# Altium project RPi_CM4_Testadapter.PrjPcb
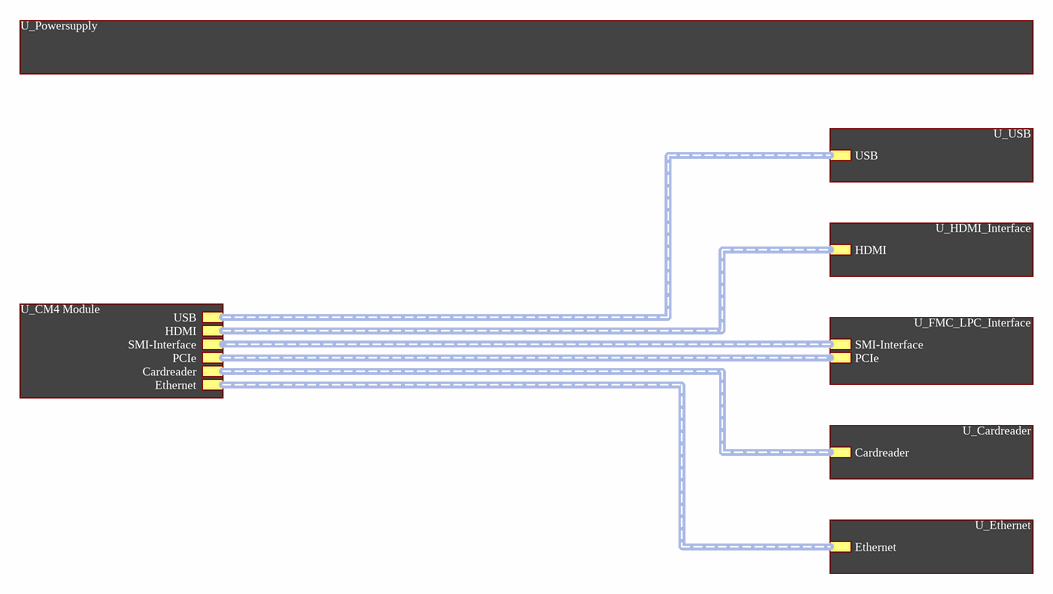
[diagram p0: 00_Top_Level_Sheet.SchDoc]
8 sheets, 141 parts. Net scope: hierarchical (ports join the sheet entries above them; power ports are global).
Board file: CM4 to FMC Adapter r2.0.PcbDoc
Sheets:
  00_Top_Level_Sheet.SchDoc
    U_Powersupply = 01_Powersupply.SchDoc
    U_CM4 Module = 02_CM4 Module.SchDoc
    U_Cardreader = 05_Cardreader.SchDoc
    U_Ethernet = 06_Ethernet.SchDoc
    U_USB = 03_USB.SchDoc
    U_HDMI_Interface = 04_HDMI_Interface.SchDoc
    U_FMC_LPC_Interface = 07_FMC_LPC_Interface.SchDoc

## Sheet 00_Top_Level_Sheet.SchDoc
size A3

### Sub-sheets
U_Cardreader = 05_Cardreader.SchDoc: Cardreader (harness Cardreader)
U_CM4 Module = 02_CM4 Module.SchDoc: Ethernet (harness Ethernet), Cardreader (harness Cardreader), SMI-Interface (harness SMI-Interface), HDMI (harness HDMI), USB (harness USB-A), PCIe (harness PCIe)
U_Ethernet = 06_Ethernet.SchDoc: Ethernet (harness Ethernet)
U_FMC_LPC_Interface = 07_FMC_LPC_Interface.SchDoc: SMI-Interface (harness SMI-Interface), PCIe (harness PCIe)
U_HDMI_Interface = 04_HDMI_Interface.SchDoc: HDMI (harness HDMI)
U_Powersupply = 01_Powersupply.SchDoc: no entries
U_USB = 03_USB.SchDoc: USB (harness USB-A)

### Buses and harness runs
harness sheet U_Cardreader/Cardreader = sheet U_CM4 Module/Cardreader
harness sheet U_CM4 Module/Ethernet = sheet U_Ethernet/Ethernet
harness sheet U_CM4 Module/HDMI = sheet U_HDMI_Interface/HDMI
harness sheet U_CM4 Module/PCIe = sheet U_FMC_LPC_Interface/PCIe
harness sheet U_CM4 Module/SMI-Interface = sheet U_FMC_LPC_Interface/SMI-Interface
harness sheet U_CM4 Module/USB = sheet U_USB/USB

### Notes on the sheet
- Title:
- ++CONFIDENTIAL++
- Date:
- Sheet:
- /
- Time:
- Engineer
- Elektronik- und Softwareentwicklung aus Nürnberg
- The  information  contained  in  these  documents  is  confidential,  privileged  and  only  for  the
  information of the intended recipient and may
  not be used, published or redistributed without
  the prior written consent from PCB Arts GmbH.
- Revision:
- Checked:
- https://pcb-arts.com/
- mail@pcb-arts.com

## Sheet 01_Powersupply.SchDoc
size A3
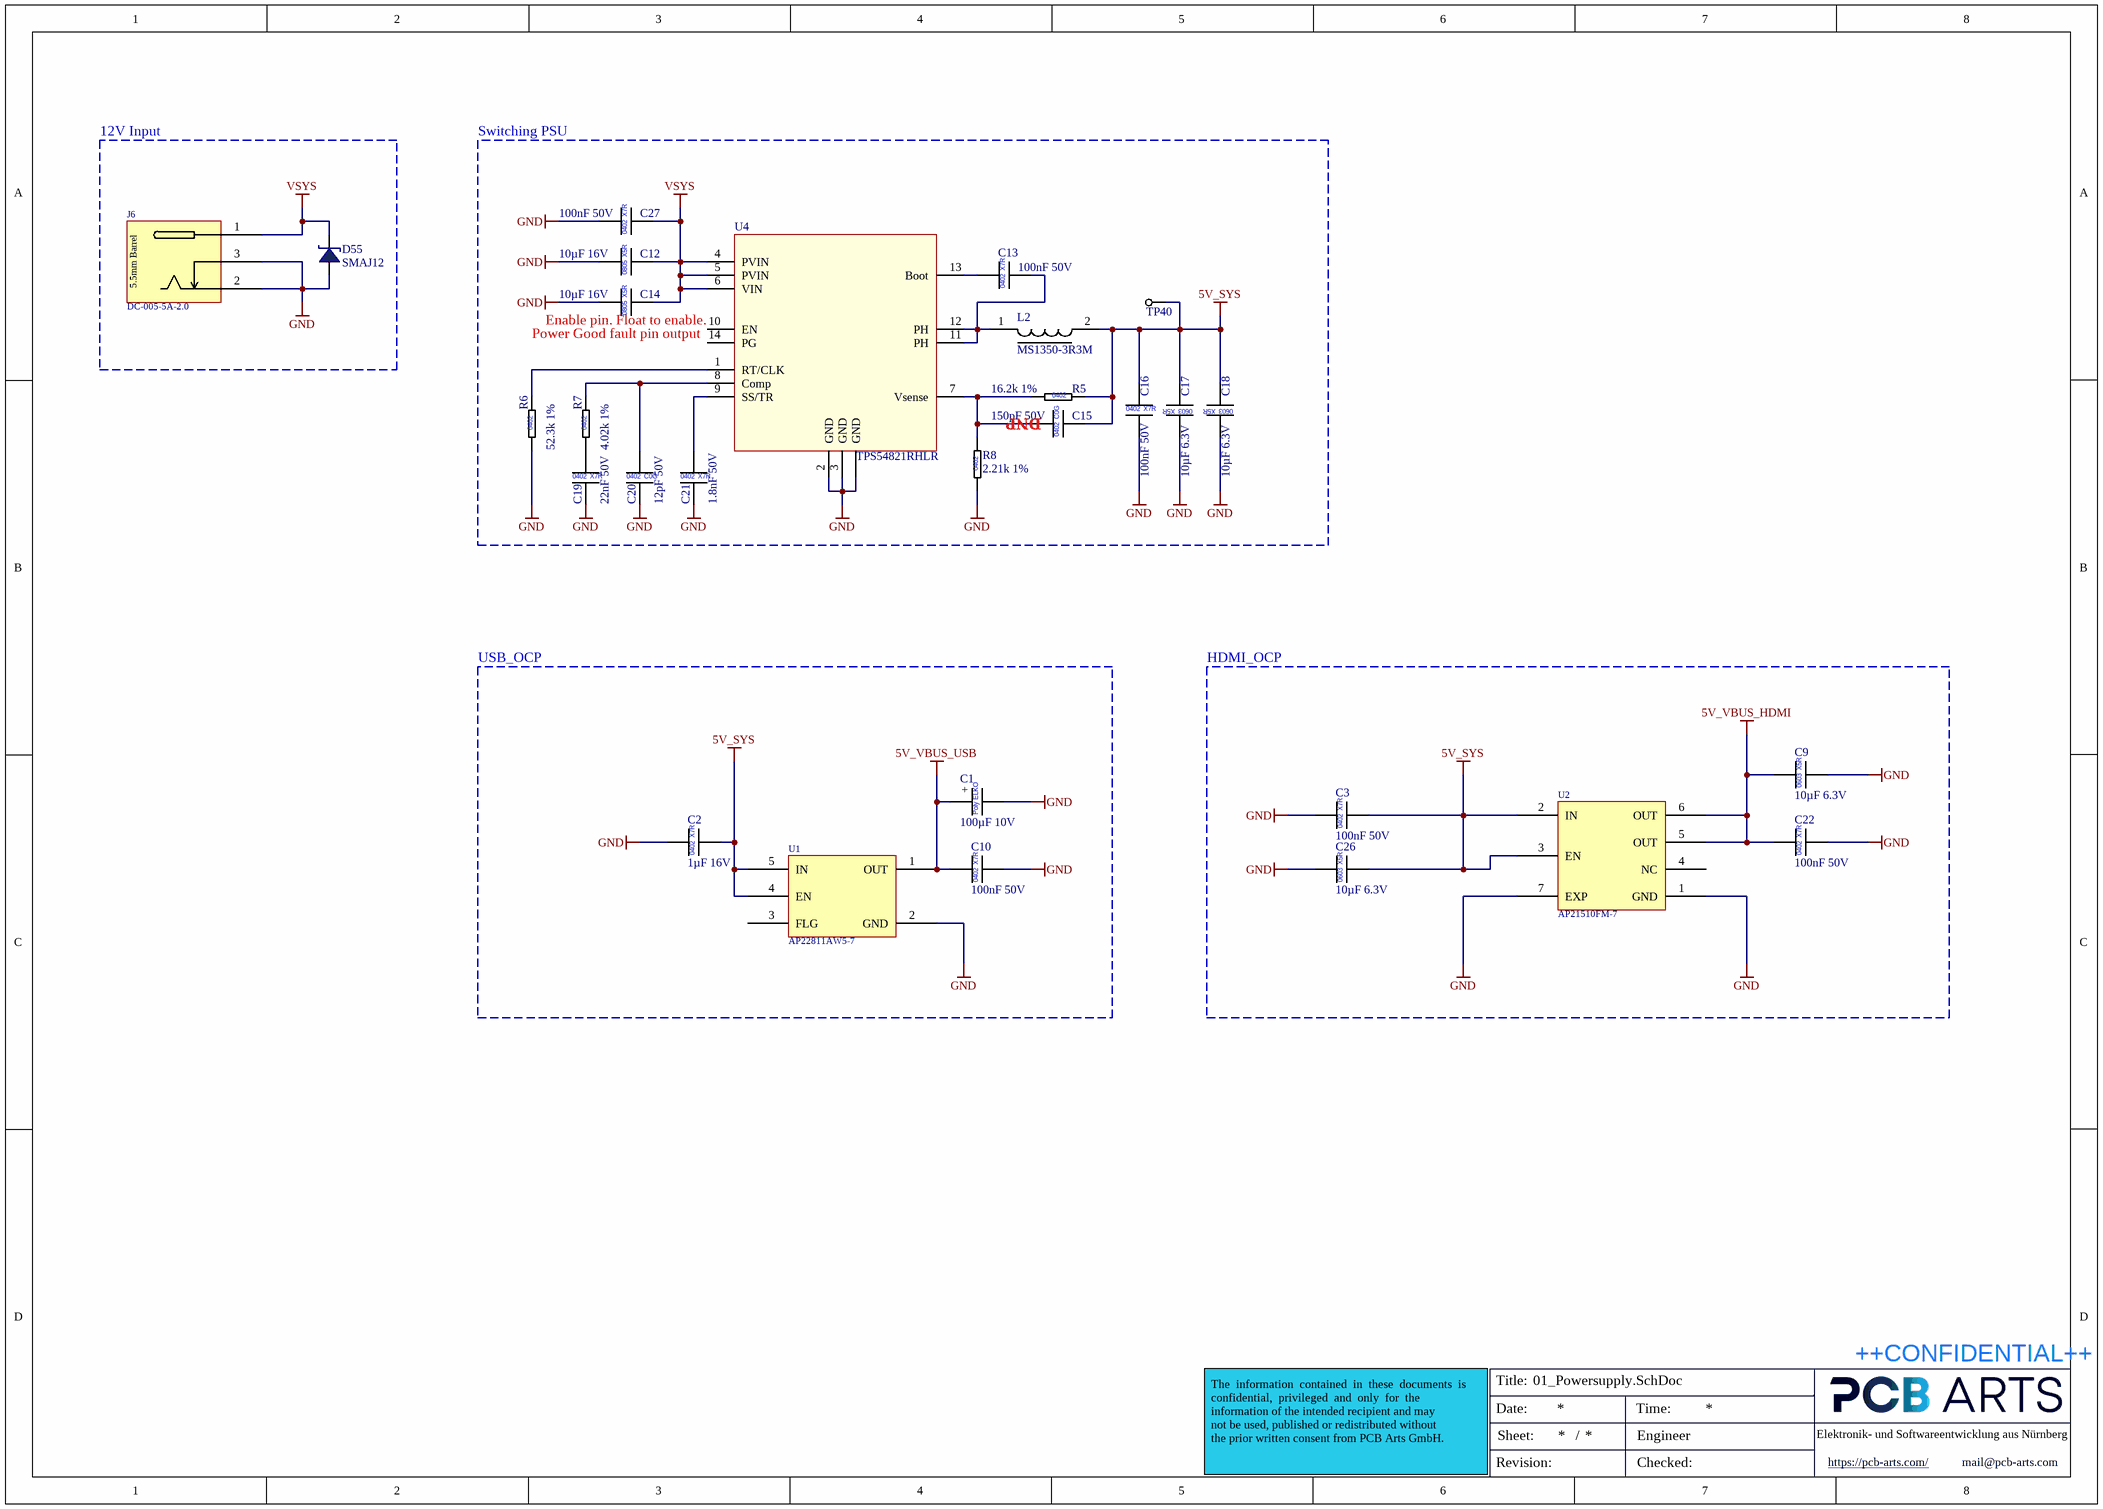
[diagram p1: 01_Powersupply.SchDoc]

### Parts
C1  100µF 10V  [WCAP-ASLI_D5H5.5]
C2  1µF 16V  [CAP_0402]
C3  100nF 50V  [CAP_0402]
C9  10µF 6.3V  [CAP_0603]
C10  100nF 50V  [CAP_0402]
C12  10µF 16V  [CAP_0805]
C13  100nF 50V  [CAP_0402]
C14  10µF 16V  [CAP_0805]
C15  150pF 50V  [CAP_0402]  (no BOM)
C16  100nF 50V  [CAP_0402]
C17  10µF 6.3V  [CAP_0603]
C18  10µF 6.3V  [CAP_0603]
C19  22nF 50V  [CAP_0402]
C20  12pF 50V  [CAP_0402]
C21  1.8nF 50V  [CAP_0402]
C22  100nF 50V  [CAP_0402]
C26  10µF 6.3V  [CAP_0603]
C27  100nF 50V  [CAP_0402]
D55  SMAJ12  [DO214AC]
J6  DC-005-5A-2.0  [DC-005-5A-2.0]
L2  MS1350-3R3M  [MS1350]
R5  16.2k 1%  [RES_0402]
R6  52.3k 1%  [RES_0402]
R7  4.02k 1%  [RES_0402]
R8  2.21k 1%  [RES_0402]
TP40  Testpoint  [Testpoint 0.8mm]  (value not drawn)  (no BOM)
U1  AP22811AW5-7  [SOT95P285X140-5N]
U2  AP21510FM-7  [QFN50P201X181X60_HS-7N]
U4  TPS54821RHLR  [VQFN14U3535]

### Blocks framed on the sheet
12V Input: D55 J6
DNP: C12-C21 C27 L2 R5-R8 TP40 U4
USB_OCP: C1 C2 C10 U1
HDMI_OCP: C3 C9 C22 C26 U2

### Nets
5V_SYS: C2.2 C3.2 C15.2 C16.1 C17.2 C18.2 C26.2 L2.2 R5.2 TP40.1(GND) U1.4(EN) U1.5(IN) U2.2(IN) U2.3(EN)
5V_VBUS_HDMI: C9.1 C22.1 U2.5(OUT) U2.6(OUT)
5V_VBUS_USB: C1.1 C10.1 U1.1(OUT)
GND: C1.2 C2.1 C3.1 C9.2 C10.2 C12.1 C14.1 C16.2 C17.1 C18.1 C19.2 C20.2 C21.2 C22.2 C26.1 C27.1 D55.2 J6.2 J6.3 R6.1 R8.1 U1.2(GND) U2.1(GND) U2.7(EXP) U4.2(GND) U4.3(GND) U4.EXP(GND)
VSYS: C12.2 C14.2 C27.2 D55.1 J6.1 U4.4(PVIN) U4.5(PVIN) U4.6(VIN)
NetC13_1: C13.1 U4.13(Boot)
NetC13_2: C13.2 L2.1 U4.11(PH) U4.12(PH)
NetC15_1: C15.1 R5.1 R8.2 U4.7(Vsense)
NetC19_1: C19.1 R7.1
NetC20_1: C20.1 R7.2 U4.8(Comp)
NetC21_1: C21.1 U4.9(SS/TR)
NetR6_2: R6.2 U4.1(RT/CLK)

Not connected (* = marked no-connect by the designer): U1 3(FLG); U2 4(NC); U4 10(EN) 14(PG)

### Notes on the sheet
- Switching PSU
- (near U4) Power Good fault pin output
- (near U4) Enable pin. Float to enable.
- Title:
- ++CONFIDENTIAL++
- Date:
- Sheet:
- /
- Time:
- Engineer
- Elektronik- und Softwareentwicklung aus Nürnberg
- The  information  contained  in  these  documents  is  confidential,  privileged  and  only  for  the
  information of the intended recipient and may
  not be used, published or redistributed without
  the prior written consent from PCB Arts GmbH.
- Revision:
- Checked:
- https://pcb-arts.com/
- mail@pcb-arts.com
- (in symbol CAP_0402_1.8nF_50V) 0402; X7R
- (in symbol CAP_0402_1µF_16V) X7R; 0402
- (in symbol CAP_0402_12pF_50V) 0402; C0G
- (in symbol CAP_0402_22nF_50V) 0402; X7R
- (in symbol CAP_0402_100nF_50V) X7R; 0402
- (in symbol CAP_0402_150pF_50V) C0G; 0402
- (in symbol CAP_0603_10µF_6.3V) X5R; 0603
- (in symbol CAP_0805_10µF_16V) X5R; 0805
- (in symbol CAP_D5L5.5_100µF_10V) +; Poly ELKO
- (in symbol DC-005-5A-2.0_DC Power Receptacle Jack 5.5/2.1mm) 5.5mm Barrel
- (in symbol RES_0402_2.21k_1%) 0402
- (in symbol RES_0402_4.02k_1%) 0402
- (in symbol RES_0402_16.2k_1%) 0402
- (in symbol RES_0402_52.3k_1%) 0402

### Library data of the parts
C1 = CAP_D5L5.5_100µF_10V: Organische Polymer-Aluminiumkondensatoren 100uF 10 Volts 20%; Manufacturer 1: Würth Elektronik; Manufacturer 1 Prt. Nr.: 875105242010
C2 = CAP_0402_1µF_16V: Multilayer Ceramic Capacitors MLCC - SMD/SMT 0402 16VDC; Manufacturer 1: Taiyo Yuden; Manufacturer 1 Prt. Nr.: EMK105BJ105MVHF; Manufacturer 2 Prt. Nr.: GRM155R61E105KA12D; Manufacturer 2: Murata Electronics
C3 C10 C13 C16 C22 C27 = CAP_0402_100nF_50V: Multilayer Ceramic Capacitors MLCC - SMD/SMT 0402 50VDC; Manufacturer 1: Murata Electronics; Manufacturer 1 Prt. Nr.: GCM155L8EH104KE07D; Manufacturer 2 Prt. Nr.: UMK105B7104KV-FR; Manufacturer 2: TDK
C9 C17 C18 C26 = CAP_0603_10µF_6.3V: Multilayer Ceramic Capacitors MLCC - SMD/SMT 0603 6.3VDC; Manufacturer 1: Murata Electronics; Manufacturer 1 Prt. Nr.: GRM188R60J106ME84J; Manufacturer 2 Prt. Nr.: JMK107ABJ106MA-T; Manufacturer 2: Taiyo Yuden
C12 C14 = CAP_0805_10µF_16V: Multilayer Ceramic Capacitors MLCC - SMD/SMT 0805 16VDC; Manufacturer 1: Taiyo Yuden; Manufacturer 1 Prt. Nr.: EMK212ABJ106KG-T; Manufacturer 2 Prt. Nr.: C2012X5R1C106K085AC; Manufacturer 2: TDK
C15 = CAP_0402_150pF_50V: Multilayer Ceramic Capacitors MLCC - SMD/SMT 0402 50VDC; Manufacturer 1: Murata Electronics; Manufacturer 1 Prt. Nr.: GCM1555C1H151JA16J; Manufacturer 2 Prt. Nr.: C0402C151J5GACTU; Manufacturer 2: KEMET
C19 = CAP_0402_22nF_50V: Multilayer Ceramic Capacitors MLCC - SMD/SMT 0402 50VDC; Manufacturer 1: Murata Electronics; Manufacturer 1 Prt. Nr.: GCM155R71H223KA55D; Manufacturer 2 Prt. Nr.: UMK105B7223KV-FR; Manufacturer 2: TDK
C20 = CAP_0402_12pF_50V: Multilayer Ceramic Capacitors MLCC - SMD/SMT 0402 50VDC; Manufacturer 1: Murata Electronics; Manufacturer 1 Prt. Nr.: GCM1555C1H120JA16J; Manufacturer 2 Prt. Nr.: C0402C120J5GACTU; Manufacturer 2: KEMET
C21 = CAP_0402_1.8nF_50V: Multilayer Ceramic Capacitors MLCC - SMD/SMT 0402 50VDC; Manufacturer 1: Yageo; Manufacturer 1 Prt. Nr.: CC0402JRX7R9BB182; Manufacturer 2 Prt. Nr.: GCM155R71H182JA37D; Manufacturer 2: Murata Electronics
D55 = SMAJ12_TVS Diode, 12V, Unidirectional: TVS Diode, 12V, Unidirectional; Manufacturer 1: Littelfuse; Manufacturer 1 Prt. Nr.: SMAJ12A
J6 = DC-005-5A-2.0_DC Power Receptacle Jack 5.5/2.1mm: DC Power Receptacle Jack 5.5/2.1mm; Manufacturer 1: XKB Enterprise; Manufacturer 1 Prt. Nr.: DC-005-5A-2.0
L2 = MS1350-3R3M  _3.3uH ±20% 13A 7.5mΩ SMD,13.8x12.6x5mm Inductor: 3.3uH ±20% 13A 7.5mΩ SMD,13.8x12.6x5mm Inductor; Manufacturer 1: COILMX; Manufacturer 1 Prt. Nr.: MS1350-3R3M
R5 = RES_0402_16.2k_1%: Thick Film Resistors - SMD 16.2kOhm 1%; Manufacturer 1: Vishay / Dale; Manufacturer 1 Prt. Nr.: CRCW040216K2FKED; Manufacturer 2 Prt. Nr.: RC0402FR-0716K2L; Manufacturer 2: Yageo
R6 = RES_0402_52.3k_1%: Thick Film Resistors - SMD 52.3kOhm 1%; Manufacturer 1: Vishay / Dale; Manufacturer 1 Prt. Nr.: CRCW040252K3FKEDC; Manufacturer 2 Prt. Nr.: AC0402FR-0752K3L; Manufacturer 2: Yageo
R7 = RES_0402_4.02k_1%: Thick Film Resistors - SMD 4.02kOhm 1%; Manufacturer 1: Vishay / Dale; Manufacturer 1 Prt. Nr.: CRCW04024K02FKEDC; Manufacturer 2 Prt. Nr.: ERJ-2RKF4021X; Manufacturer 2: Panasonic
R8 = RES_0402_2.21k_1%: Thick Film Resistors - SMD 2.21kOhm 1%; Manufacturer 1: Vishay / Dale; Manufacturer 1 Prt. Nr.: CRCW04022K21FKEDC; Manufacturer 2 Prt. Nr.: RC0402FR-7W2K21L; Manufacturer 2: Yageo
TP40 = Testpoint 0.8mm
U1 = AP22811AW5-7_Power Switch ICs - Power Distribution Load Switch: Power Switch ICs - Power Distribution Load Switch; Manufacturer 1: Diodes Incorporated; Manufacturer 1 Prt. Nr.: AP22811AW5-7
U2 = AP21510FM-7_Power Switch ICs - Power Distribution Load Switch: Power Switch ICs - Power Distribution 0.5A SGL Ch USB 2.0 Curr Limited Switch; Manufacturer 1: Diodes Incorporated; Manufacturer 1 Prt. Nr.: AP21510FM-7
U4 = TPS54821RHLR_4.5 V to 17 V Input, 8 A Synchronous Step Down Converter: 4.5 V to 17 V Input, 8 A Synchronous Step Down Converter; Manufacturer 1: Texas Instruments; Manufacturer 1 Prt. Nr.: TPS54821RHLR

## Sheet 02_CM4 Module.SchDoc
size A3
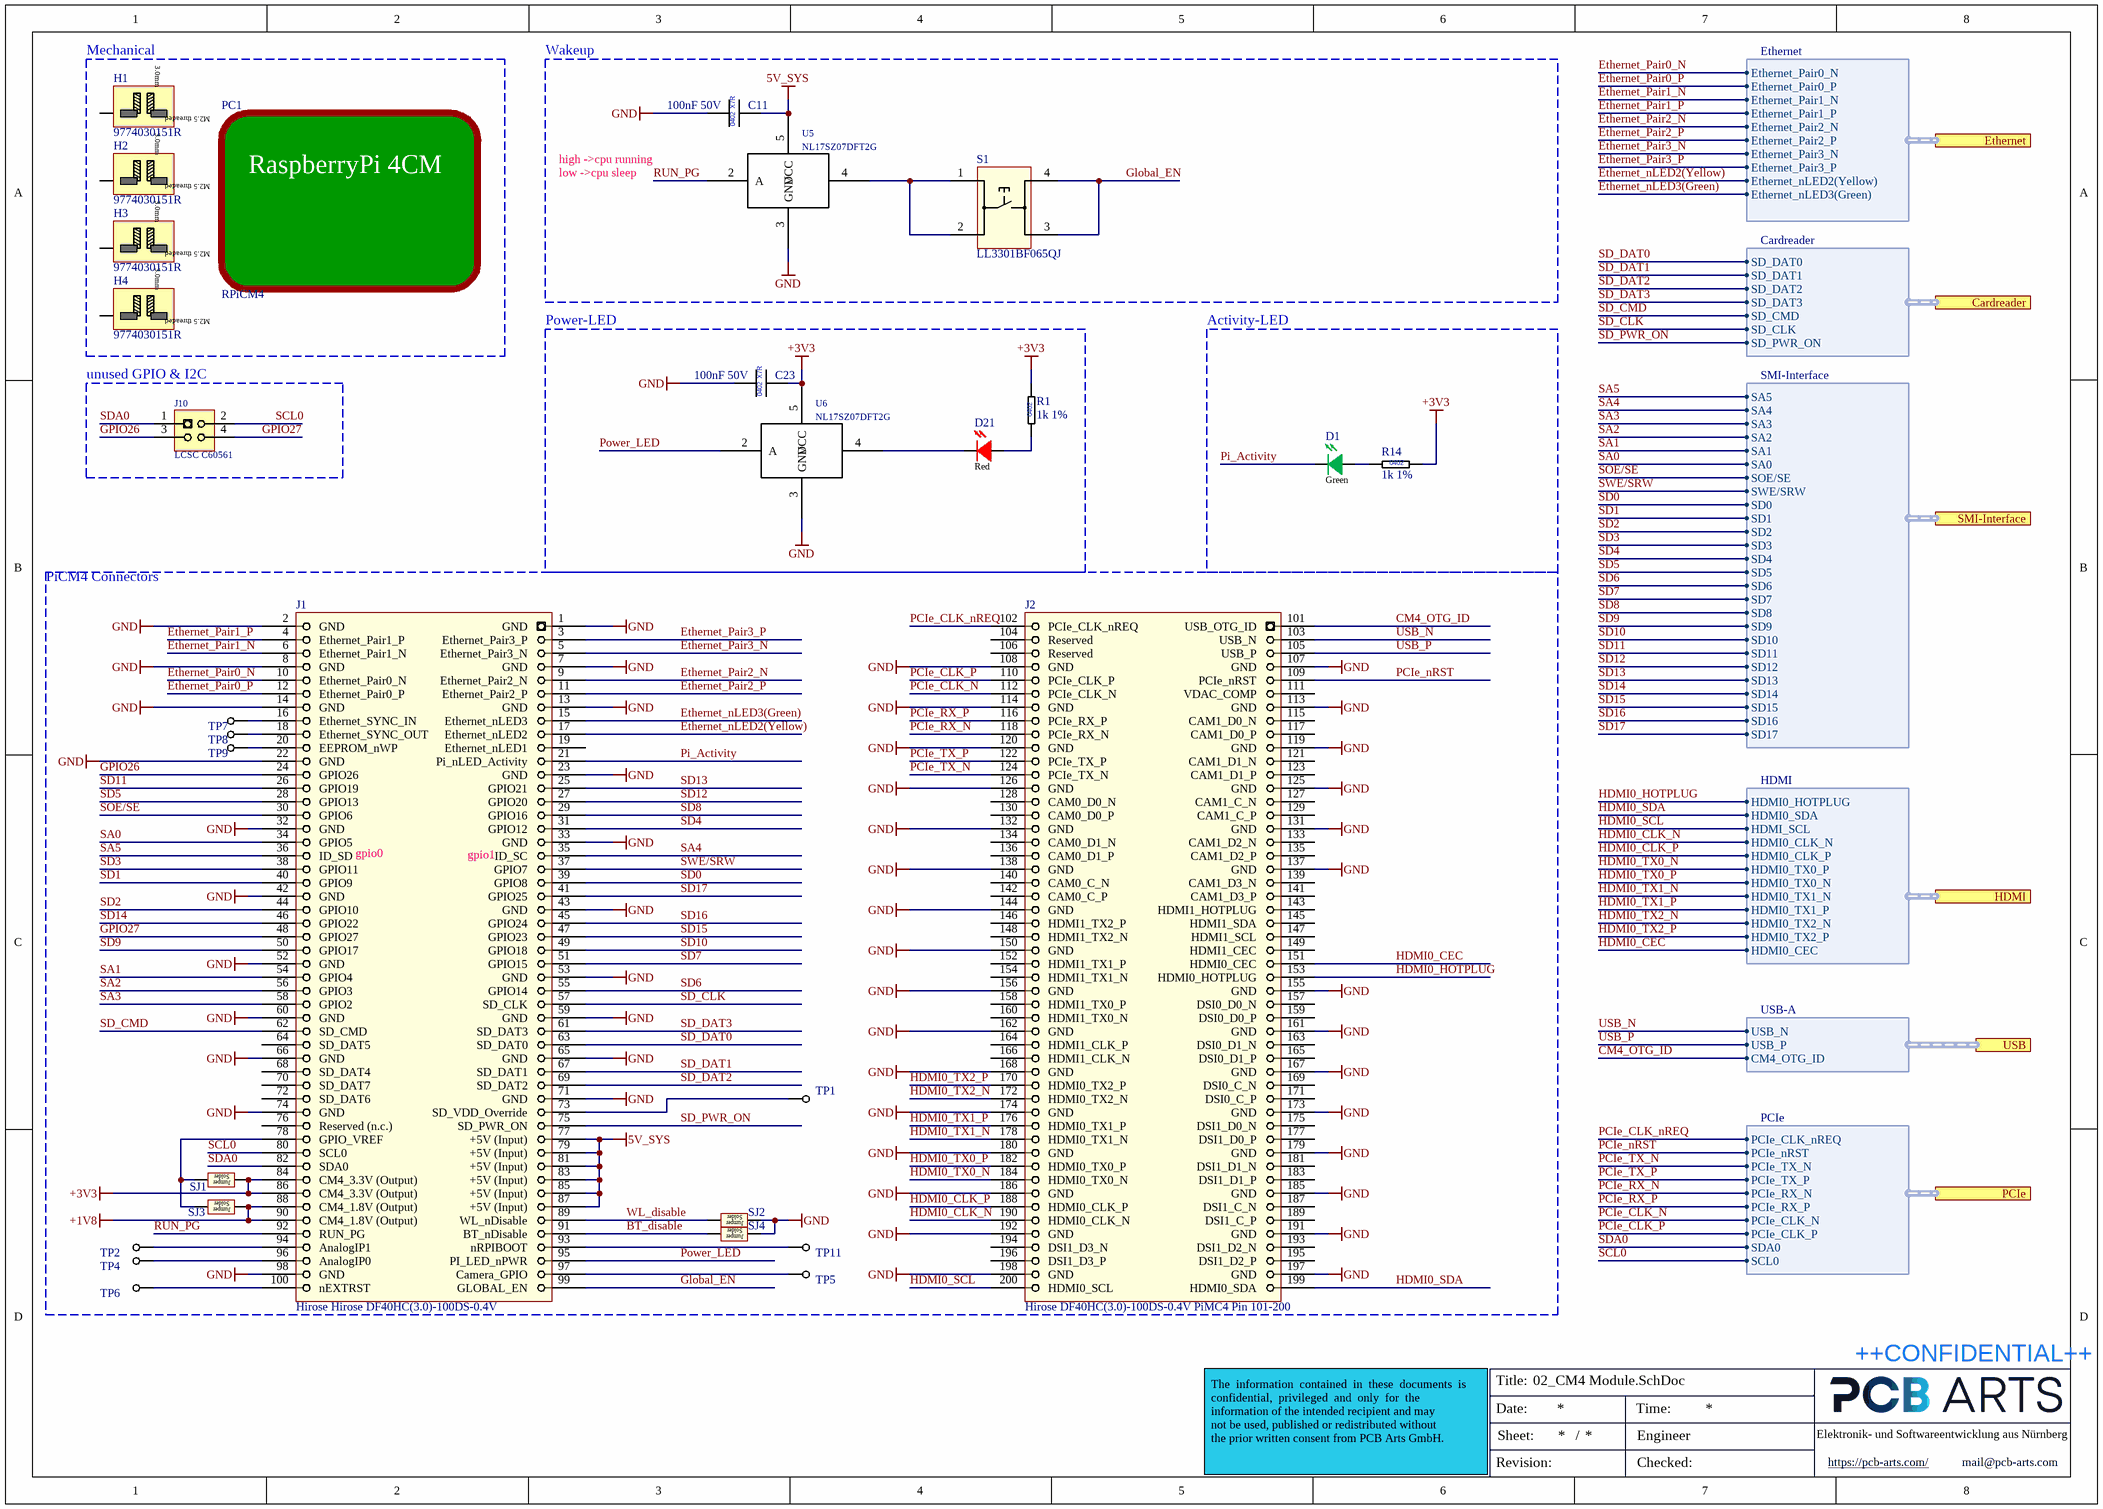
[diagram p2: 02_CM4 Module.SchDoc]

### Parts
C11  100nF 50V  [CAP_0402]
C23  100nF 50V  [CAP_0402]
D1  Color: Green  [LED-0603 Sideview]  (hidden comment: LTST-S270KGKT)
D21  Color: Red  [LED-0603 Sideview]  (hidden comment: LTST-S270KRKT)
H1  9774030151R  [9774030151R]
H2  9774030151R  [9774030151R]
H3  9774030151R  [9774030151R]
H4  9774030151R  [9774030151R]
J1  Hirose Hirose DF40HC(3.0)-100DS-0.4V  [Hirose DF40HC(3.0)-100DS-0.4V_1-100]
J2  Hirose DF40HC(3.0)-100DS-0.4V PiMC4 Pin 101-200  [Hirose DF40HC(3.0)-100DS-0.4V_PiCM4_101_200]
J10  LCSC C60561  [LCSC C60561]
PC1  RPiCM4  [RaspberryPi_CM4]
R1  1k 1%  [RES_0402]
R14  1k 1%  [RES_0402]
S1  LL3301BF065QJ  [LL3301BF065QJ]
SJ1  Solderbridge_0402  [Solderbridge_0402]  (value not drawn)
SJ2  Solderbridge_0402  [Solderbridge_0402]  (value not drawn)
SJ3  Solderbridge_0402  [Solderbridge_0402]  (value not drawn)
SJ4  Solderbridge_0402  [Solderbridge_0402]  (value not drawn)
TP1  Testpoint  [Testpoint 0.8mm]  (value not drawn)  (no BOM)
TP2  Testpoint  [Testpoint 0.8mm]  (value not drawn)  (no BOM)
TP4  Testpoint  [Testpoint 0.8mm]  (value not drawn)  (no BOM)
TP5  Testpoint  [Testpoint 0.8mm]  (value not drawn)  (no BOM)
TP6  Testpoint  [Testpoint 0.8mm]  (value not drawn)  (no BOM)
TP7  Testpoint  [Testpoint 0.8mm]  (value not drawn)  (no BOM)
TP8  Testpoint  [Testpoint 0.8mm]  (value not drawn)  (no BOM)
TP9  Testpoint  [Testpoint 0.8mm]  (value not drawn)  (no BOM)
TP11  Testpoint  [Testpoint 0.8mm]  (value not drawn)  (no BOM)
U5  NL17SZ07DFT2G  [SOT65P210X110-5N]
U6  NL17SZ07DFT2G  [SOT65P210X110-5N]

### Blocks framed on the sheet
Mechanical: H1-H4 PC1
Wakeup: C11 S1 U5
Power-LED: C23 D21 R1 U6
Activity-LED: D1 R14
unused GPIO & I2C: J10
PiCM4 Connectors: J1 J2 SJ1-SJ4 TP1 TP2 TP4-TP9 TP11

### Ports
Cardreader (harness Cardreader), Ethernet (harness Ethernet), HDMI (harness HDMI), PCIe (harness PCIe), SMI-Interface (harness SMI-Interface), USB (harness USB-A)

### Harnesses
Ethernet: Ethernet_Pair0_N, Ethernet_Pair0_P, Ethernet_Pair1_N, Ethernet_Pair1_P, Ethernet_Pair2_N, Ethernet_Pair2_P, Ethernet_Pair3_N, Ethernet_Pair3_P, Ethernet_nLED2(Yellow), Ethernet_nLED3(Green)
Cardreader: SD_DAT0, SD_DAT1, SD_DAT2, SD_DAT3, SD_CMD, SD_CLK, SD_PWR_ON
SMI-Interface: SA5, SA4, SA3, SA2, SA1, SA0, SOE/SE, SWE/SRW, SD0, SD1, SD2, SD3, SD4, SD5, SD6, SD7, SD8, SD9, SD10, SD11, SD12, SD13, SD14, SD15, SD16, SD17
HDMI: HDMI0_HOTPLUG, HDMI0_SDA, HDMI_SCL, HDMI0_CLK_N, HDMI0_CLK_P, HDMI0_TX0_P, HDMI0_TX0_N, HDMI0_TX1_N, HDMI0_TX1_P, HDMI0_TX2_N, HDMI0_TX2_P, HDMI0_CEC
PCIe: PCIe_CLK_nREQ, PCIe_nRST, PCIe_TX_N, PCIe_TX_P, PCIe_RX_N, PCIe_RX_P, PCIe_CLK_N, PCIe_CLK_P, SDA0, SCL0
USB-A: USB_N, USB_P, CM4_OTG_ID

### Nets
5V_SYS: C11.2 J1.77(+5V_(Input)) J1.79(+5V_(Input)) J1.81(+5V_(Input)) J1.83(+5V_(Input)) J1.85(+5V_(Input)) J1.87(+5V_(Input)) U5.5(VCC)
+1V8: J1.88(CM4_1.8V_(Output)) J1.90(CM4_1.8V_(Output)) SJ3.2
+3V3: C23.2 J1.84(CM4_3.3V_(Output)) J1.86(CM4_3.3V_(Output)) R1.2 R14.2 SJ1.2 U6.5(VCC)
GND: C11.1 C23.1 J1.1(GND) J1.2(GND) J1.7(GND) J1.8(GND) J1.13(GND) J1.14(GND) J1.22(GND) J1.23(GND) J1.32(GND) J1.33(GND) J1.42(GND) J1.43(GND) J1.52(GND) J1.53(GND) J1.59(GND) J1.60(GND) J1.65(GND) J1.66(GND) J1.71(GND) J1.74(GND) J1.98(GND) J2.107(GND) J2.108(GND) J2.113(GND) J2.114(GND) J2.119(GND) J2.120(GND) J2.125(GND) J2.126(GND) J2.131(GND) J2.132(GND) J2.137(GND) J2.138(GND) J2.144(GND) J2.150(GND) J2.155(GND) J2.156(GND) J2.161(GND) J2.162(GND) J2.167(GND) J2.168(GND) J2.173(GND) J2.174(GND) J2.179(GND) J2.180(GND) J2.185(GND) J2.186(GND) J2.191(GND) J2.192(GND) J2.197(GND) J2.198(GND) SJ2.2 SJ4.2 U5.3(GND) U6.3(GND)
BT_disable: J1.91(BT_nDisable) SJ4.1
CM4_OTG_ID: J2.101(USB_OTG_ID) ; port USB.CM4_OTG_ID
Ethernet_nLED2(Yellow): J1.17(Ethernet_nLED2) ; port Ethernet.Ethernet_nLED2(Yellow)
Ethernet_nLED3(Green): J1.15(Ethernet_nLED3) ; port Ethernet.Ethernet_nLED3(Green)
Ethernet_Pair0_N: J1.10(Ethernet_Pair0_N) ; port Ethernet.Ethernet_Pair0_N
Ethernet_Pair0_P: J1.12(Ethernet_Pair0_P) ; port Ethernet.Ethernet_Pair0_P
Ethernet_Pair1_N: J1.6(Ethernet_Pair1_N) ; port Ethernet.Ethernet_Pair1_N
Ethernet_Pair1_P: J1.4(Ethernet_Pair1_P) ; port Ethernet.Ethernet_Pair1_P
Ethernet_Pair2_N: J1.9(Ethernet_Pair2_N) ; port Ethernet.Ethernet_Pair2_N
Ethernet_Pair2_P: J1.11(Ethernet_Pair2_P) ; port Ethernet.Ethernet_Pair2_P
Ethernet_Pair3_N: J1.5(Ethernet_Pair3_N) ; port Ethernet.Ethernet_Pair3_N
Ethernet_Pair3_P: J1.3(Ethernet_Pair3_P) ; port Ethernet.Ethernet_Pair3_P
Global_EN: J1.99(GLOBAL_EN) S1.3 S1.4
GPIO26: J1.24(GPIO26) J10.3
GPIO27: J1.48(GPIO27) J10.4
HDMI0_CEC: J2.151(HDMI0_CEC) ; port HDMI.HDMI0_CEC
HDMI0_CLK_N: J2.190(HDMI0_CLK_N) ; port HDMI.HDMI0_CLK_N
HDMI0_CLK_P: J2.188(HDMI0_CLK_P) ; port HDMI.HDMI0_CLK_P
HDMI0_HOTPLUG: J2.153(HDMI0_HOTPLUG) ; port HDMI.HDMI0_HOTPLUG
HDMI0_SCL: J2.200(HDMI0_SCL) ; port HDMI.HDMI_SCL
HDMI0_SDA: J2.199(HDMI0_SDA) ; port HDMI.HDMI0_SDA
HDMI0_TX0_N: J2.184(HDMI0_TX0_N) ; port HDMI.HDMI0_TX0_P
HDMI0_TX0_P: J2.182(HDMI0_TX0_P) ; port HDMI.HDMI0_TX0_N
HDMI0_TX1_N: J2.178(HDMI0_TX1_N) ; port HDMI.HDMI0_TX1_N
HDMI0_TX1_P: J2.176(HDMI0_TX1_P) ; port HDMI.HDMI0_TX1_P
HDMI0_TX2_N: J2.172(HDMI0_TX2_N) ; port HDMI.HDMI0_TX2_N
HDMI0_TX2_P: J2.170(HDMI0_TX2_P) ; port HDMI.HDMI0_TX2_P
PCIe_CLK_N: J2.112(PCIe_CLK_N) ; port PCIe.PCIe_CLK_N
PCIe_CLK_nREQ: J2.102(PCIe_CLK_nREQ) ; port PCIe.PCIe_CLK_nREQ
PCIe_CLK_P: J2.110(PCIe_CLK_P) ; port PCIe.PCIe_CLK_P
PCIe_nRST: J2.109(PCIe_nRST) ; port PCIe.PCIe_nRST
PCIe_RX_N: J2.118(PCIe_RX_N) ; port PCIe.PCIe_RX_N
PCIe_RX_P: J2.116(PCIe_RX_P) ; port PCIe.PCIe_RX_P
PCIe_TX_N: J2.124(PCIe_TX_N) ; port PCIe.PCIe_TX_N
PCIe_TX_P: J2.122(PCIe_TX_P) ; port PCIe.PCIe_TX_P
Pi_Activity: D1.1 J1.21(Pi_nLED_Activity)
Power_LED: J1.95(PI_LED_nPWR) U6.2(A)
RUN_PG: J1.92(RUN_PG) U5.2(A)
SA0: J1.34(GPIO5) ; port SMI-Interface.SA0
SA1: J1.54(GPIO4) ; port SMI-Interface.SA1
SA2: J1.56(GPIO3) ; port SMI-Interface.SA2
SA3: J1.58(GPIO2) ; port SMI-Interface.SA3
SA4: J1.35(ID_SC) ; port SMI-Interface.SA4
SA5: J1.36(ID_SD) ; port SMI-Interface.SA5
SCL0: J1.80(SCL0) J10.2 ; port PCIe.SCL0
SD0: J1.39(GPIO8) ; port SMI-Interface.SD0
SD1: J1.40(GPIO9) ; port SMI-Interface.SD1
SD2: J1.44(GPIO10) ; port SMI-Interface.SD2
SD3: J1.38(GPIO11) ; port SMI-Interface.SD3
SD4: J1.31(GPIO12) ; port SMI-Interface.SD4
SD5: J1.28(GPIO13) ; port SMI-Interface.SD5
SD6: J1.55(GPIO14) ; port SMI-Interface.SD6
SD7: J1.51(GPIO15) ; port SMI-Interface.SD7
SD8: J1.29(GPIO16) ; port SMI-Interface.SD8
SD9: J1.50(GPIO17) ; port SMI-Interface.SD9
SD10: J1.49(GPIO18) ; port SMI-Interface.SD10
SD11: J1.26(GPIO19) ; port SMI-Interface.SD11
SD12: J1.27(GPIO20) ; port SMI-Interface.SD12
SD13: J1.25(GPIO21) ; port SMI-Interface.SD13
SD14: J1.46(GPIO22) ; port SMI-Interface.SD14
SD15: J1.47(GPIO23) ; port SMI-Interface.SD15
SD16: J1.45(GPIO24) ; port SMI-Interface.SD16
SD17: J1.41(GPIO25) ; port SMI-Interface.SD17
SD_CLK: J1.57(SD_CLK) ; port Cardreader.SD_CLK
SD_CMD: J1.62(SD_CMD) ; port Cardreader.SD_CMD
SD_DAT0: J1.63(SD_DAT0) ; port Cardreader.SD_DAT0
SD_DAT1: J1.67(SD_DAT1) ; port Cardreader.SD_DAT1
SD_DAT2: J1.69(SD_DAT2) ; port Cardreader.SD_DAT2
SD_DAT3: J1.61(SD_DAT3) ; port Cardreader.SD_DAT3
SD_PWR_ON: J1.75(SD_PWR_ON) ; port Cardreader.SD_PWR_ON
SDA0: J1.82(SDA0) J10.1 ; port PCIe.SDA0
SOE/SE: J1.30(GPIO6) ; port SMI-Interface.SOE/SE
SWE/SRW: J1.37(GPIO7) ; port SMI-Interface.SWE/SRW
USB_N: J2.103(USB_N) ; port USB.USB_N
USB_P: J2.105(USB_P) ; port USB.USB_P
WL_disable: J1.89(WL_nDisable) SJ2.1
NetD1_2: D1.2 R14.1
NetD21_1: D21.1 U6.4(Y)
NetD21_2: D21.2 R1.1
NetJ1_16: J1.16(Ethernet_SYNC_IN) TP7.1(GND)
NetJ1_18: J1.18(Ethernet_SYNC_OUT) TP8.1(GND)
NetJ1_20: J1.20(EEPROM_nWP) TP9.1(GND)
NetJ1_73: J1.73(SD_VDD_Override) TP1.1(GND)
NetJ1_78: J1.78(GPIO_VREF) SJ1.1 SJ3.1
NetJ1_93: J1.93(nRPIBOOT) TP11.1(GND)
NetJ1_94: J1.94(AnalogIP1) TP2.1(GND)
NetJ1_96: J1.96(AnalogIP0) TP4.1(GND)
NetJ1_97: J1.97(Camera_GPIO) TP5.1(GND)
NetJ1_100: J1.100(nEXTRST) TP6.1(GND)
NetS1_1: S1.1 S1.2 U5.4(Y)

Not connected (* = marked no-connect by the designer): H1 1; H2 1; H3 1; H4 1; J1 19(Ethernet_nLED1) 64(SD_DAT5) 68(SD_DAT4) 70(SD_DAT7) 72(SD_DAT6) 76(Reserved_(n.c.)); J2 104(Reserved) 106(Reserved) 111(VDAC_COMP) 115(CAM1_D0_N) 117(CAM1_D0_P) 121(CAM1_D1_N) 123(CAM1_D1_P) 127(CAM1_C_N) 128(CAM0_D0_N) 129(CAM1_C_P) 130(CAM0_D0_P) 133(CAM1_D2_N) 134(CAM0_D1_N) 135(CAM1_D2_P) 136(CAM0_D1_P) 139(CAM1_D3_N) 140(CAM0_C_N) 141(CAM1_D3_P) 142(CAM0_C_P) 143(HDMI1_HOTPLUG) 145(HDMI1_SDA) 146(HDMI1_TX2_P) 147(HDMI1_SCL) 148(HDMI1_TX2_N) 149(HDMI1_CEC) 152(HDMI1_TX1_P) 154(HDMI1_TX1_N) 157(DSI0_D0_N) 158(HDMI1_TX0_P) 159(DSI0_D0_P) 160(HDMI1_TX0_N) 163(DSI0_D1_N) 164(HDMI1_CLK_P) 165(DSI0_D1_P) 166(HDMI1_CLK_N) 169(DSI0_C_N) 171(DSI0_C_P) 175(DSI1_D0_N) 177(DSI1_D0_P) 181(DSI1_D1_N) 183(DSI1_D1_P) 187(DSI1_C_N) 189(DSI1_C_P) 193(DSI1_D2_N) 194(DSI1_D3_N) 195(DSI1_D2_P) 196(DSI1_D3_P)

### Notes on the sheet
- high ->cpu running
- low ->cpu sleep
- (near J1) gpio0
- (near J1) gpio1
- Title:
- ++CONFIDENTIAL++
- Date:
- Sheet:
- /
- Time:
- Engineer
- Elektronik- und Softwareentwicklung aus Nürnberg
- The  information  contained  in  these  documents  is  confidential,  privileged  and  only  for  the
  information of the intended recipient and may
  not be used, published or redistributed without
  the prior written consent from PCB Arts GmbH.
- Revision:
- Checked:
- https://pcb-arts.com/
- mail@pcb-arts.com
- (in symbol CAP_0402_100nF_50V) X7R; 0402
- (in symbol Raspberry Pi Compute Module 4) RaspberryPi 4CM
- (in symbol RES_0402_1k_1%) 0402
- (in symbol Solderbridge_0402) Solder; Jumper
- (in symbol Würth Standoff M2.5 h:3.0mm) 3.0mm; M2.5 threaded

### Library data of the parts
C11 C23 = CAP_0402_100nF_50V: as C3 on sheet 01_Powersupply; Manufacturer 2: TDK
D1 = LED 0603 Green Sideview: GREEN  0603 Light Emitting Diode; Manufacturer 1: lite-On; Manufacturer 1 Prt. Nr.: LTST-S270KGKT
D21 = LED 0603 Red Sideview: RED  0603 Light Emitting Diode; Manufacturer 1: lite-On; Manufacturer 1 Prt. Nr.: LTST-S270KRKT
H1-H4 = Würth Standoff M2.5 h:3.0mm: Würth Standoff M2.5 h:3.0mm 9774030151R; Manufacturer 1: Würth Elektronik; Manufacturer 1 Prt. Nr.: 9774030151R
J1 = DF40HC(3.0)-100DS-0.4V RPiCM4 Pin 1-100: Hirose DF40HC(3.0)-100DS-0.4V 3mm heigth receptacle for Raspberry Pi CM4, Pin 1-100; Manufacturer 1: Hirose; Manufacturer 1 Prt. Nr.: DF40HC(3.0)-100DS-0.4V
J2 = DF40HC(3.0)-100DS-0.4V RPiCM4 Pin 101-200: Hirose DF40C-100DS-0.4V 3mm heigth receptacle for Raspberry Pi CM4, Pin 101-200; Manufacturer 1: Hirose; Manufacturer 1 Prt. Nr.: DF40HC(3.0)-100DS-0.4V
J10 = LCSC C60561_Pin header 2.54mm 4Pol right angle: Pin header 2.54mm 4Pol right angle; Manufacturer 1: BOOMELE(Boom Precision Elec); Manufacturer 1 Prt. Nr.: C60561
PC1 = Raspberry Pi Compute Module 4: Raspberry Pi 4 Compute Module 4; Manufacturer 1: Raspberry Pi; Manufacturer 1 Prt. Nr.: Compute Module 4
R1 R14 = RES_0402_1k_1%: Thick Film Resistors - SMD 1kOhm 1%; Manufacturer 1: Vishay / Dale; Manufacturer 1 Prt. Nr.: CRCW04021K00FKEDC; Manufacturer 2 Prt. Nr.: RC0402FR-7W1KL; Manufacturer 2: Yageo
S1 = LL3301BF065QJ_SPST Top Actuated  Button, 65gf, SMD h: 9.8mm: SPST Top Actuated  Button, 65gf, SMD h: 9.8mm; Manufacturer 1: E-Switch; Manufacturer 1 Prt. Nr.: LL3301BF065QJ
TP1 TP2 TP4-TP9 TP11 = Testpoint 0.8mm
U5 U6 = NL17SZ07DFT2G_Buffer 1.65-5.5V Single Non-Inverting: Puffer u. Leitungstreiber 1.65-5.5V Single Non-Inverting; Manufacturer 1: ON Semiconductor; Manufacturer 1 Prt. Nr.: NL17SZ07DFT2G

## Sheet 05_Cardreader.SchDoc
size A3
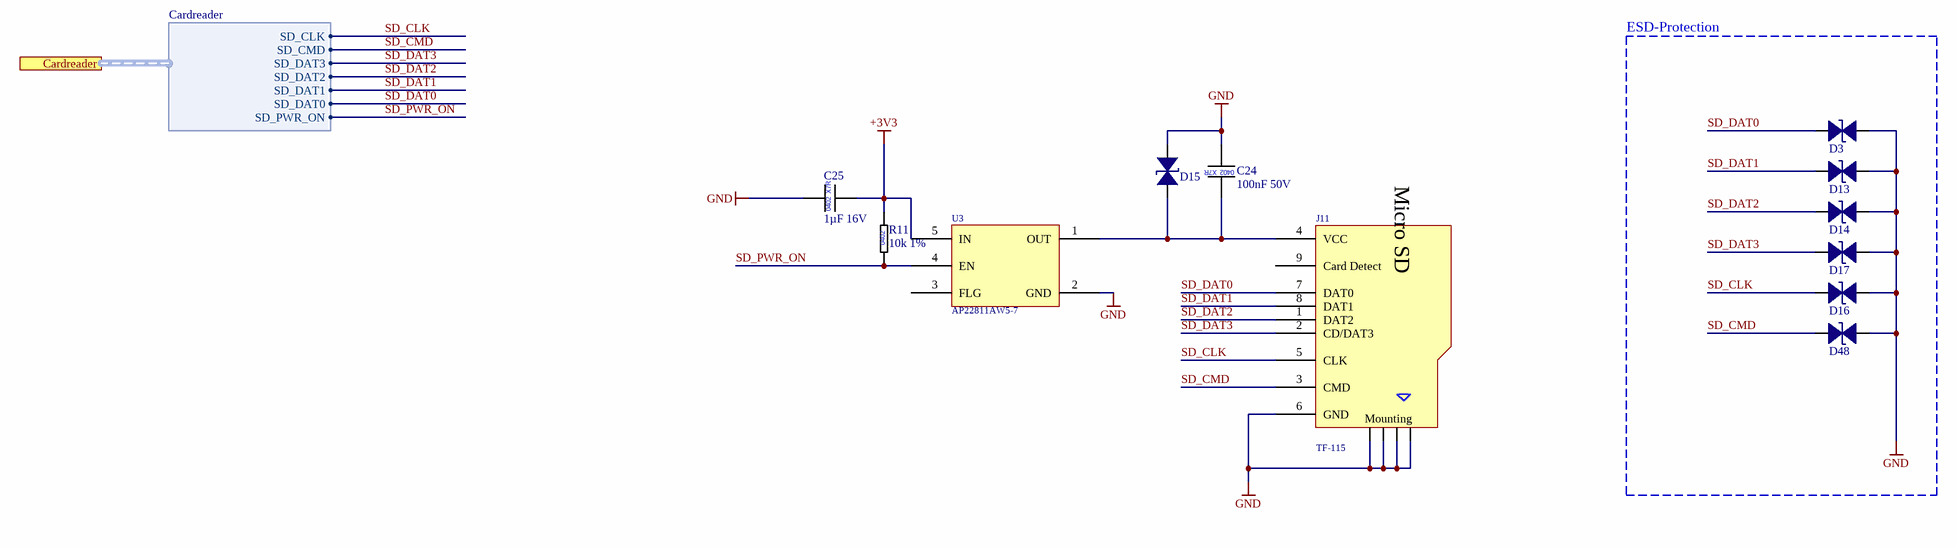
[diagram p3: 05_Cardreader.SchDoc]

### Parts
C24  100nF 50V  [CAP_0402]
C25  1µF 16V  [CAP_0402]
D3  CESDP0402UC5VB  [TVS_0402]  (value not drawn)
D13  CESDP0402UC5VB  [TVS_0402]  (value not drawn)
D14  CESDP0402UC5VB  [TVS_0402]  (value not drawn)
D15  CESDP0402UC5VB  [TVS_0402]  (value not drawn)
D16  CESDP0402UC5VB  [TVS_0402]  (value not drawn)
D17  CESDP0402UC5VB  [TVS_0402]  (value not drawn)
D48  CESDP0402UC5VB  [TVS_0402]  (value not drawn)
J11  TF-115  [TF-115]
R11  10k 1%  [RES_0402]
U3  AP22811AW5-7  [SOT95P285X140-5N]

### Blocks framed on the sheet
ESD-Protection: D3 D13 D14 D16 D17 D48

### Ports
Cardreader (harness Cardreader)

### Harnesses
Cardreader: SD_DAT0, SD_DAT1, SD_DAT2, SD_DAT3, SD_CMD, SD_CLK, SD_PWR_ON

### Nets
+3V3: C25.2 R11.2 U3.5(IN)
GND: C24.2 C25.1 D3.2 D13.2 D14.2 D15.2 D16.2 D17.2 D48.2 J11.6(GND) J11.10 J11.11 J11.12 J11.13 U3.2(GND)
SD_CLK: D16.1 J11.5(CLK) ; port Cardreader.SD_CLK
SD_CMD: D48.1 J11.3(CMD) ; port Cardreader.SD_CMD
SD_DAT0: D3.1 J11.7(DAT0) ; port Cardreader.SD_DAT0
SD_DAT1: D13.1 J11.8(DAT1) ; port Cardreader.SD_DAT1
SD_DAT2: D14.1 J11.1(DAT2) ; port Cardreader.SD_DAT2
SD_DAT3: D17.1 J11.2(CD/DAT3) ; port Cardreader.SD_DAT3
SD_PWR_ON: R11.1 U3.4(EN) ; port Cardreader.SD_PWR_ON
NetC24_1: C24.1 D15.1 J11.4(VCC) U3.1(OUT)

Not connected (* = marked no-connect by the designer): J11 9(Card_Detect); U3 3(FLG)

### Notes on the sheet
- Title:
- ++CONFIDENTIAL++
- Date:
- Sheet:
- /
- Time:
- Engineer
- Elektronik- und Softwareentwicklung aus Nürnberg
- The  information  contained  in  these  documents  is  confidential,  privileged  and  only  for  the
  information of the intended recipient and may
  not be used, published or redistributed without
  the prior written consent from PCB Arts GmbH.
- Revision:
- Checked:
- https://pcb-arts.com/
- mail@pcb-arts.com
- (in symbol CAP_0402_1µF_16V) X7R; 0402
- (in symbol CAP_0402_100nF_50V) X7R; 0402
- (in symbol RES_0402_10k_1%) 0402
- (in symbol TF-115_microSD™ Memory Card 8 connector) Micro SD; Mounting

### Library data of the parts
C24 = CAP_0402_100nF_50V: as C3 on sheet 01_Powersupply; Manufacturer 2: TDK
C25 = CAP_0402_1µF_16V: as C2 on sheet 01_Powersupply; Manufacturer 2: Murata Electronics
D3 D13-D17 D48 = CESDP0402UC5VB_TVS Diode 0402: Low Capacitance ESD Protection Diode 0402; Manufacturer 1: CREATEK; Manufacturer 2 Prt. Nr.: BPESD0402-05ST; Manufacturer 1 Prt. Nr.: CESDP0402UC5VB; Manufacturer 2: BORN
J11 = TF-115_microSD™ Memory Card 8 connector: microSD™ Memory Card 8 connector&Ejector 14.5x14.75x1.85mm Card Sockets Connector; Manufacturer 1: XUNPU; Manufacturer 1 Prt. Nr.: TF-115
R11 = RES_0402_10k_1%: Thick Film Resistors - SMD 10kOhm 1%; Manufacturer 1: Vishay / Dale; Manufacturer 1 Prt. Nr.: CRCW040210K0FKEDC; Manufacturer 2 Prt. Nr.: RC0402FR-7W10KL; Manufacturer 2: Yageo
U3 = AP22811AW5-7_Power Switch ICs - Power Distribution Load Switch: as U1 on sheet 01_Powersupply; Manufacturer 1 Prt. Nr.: AP22811AW5-7

## Sheet 06_Ethernet.SchDoc
size A3
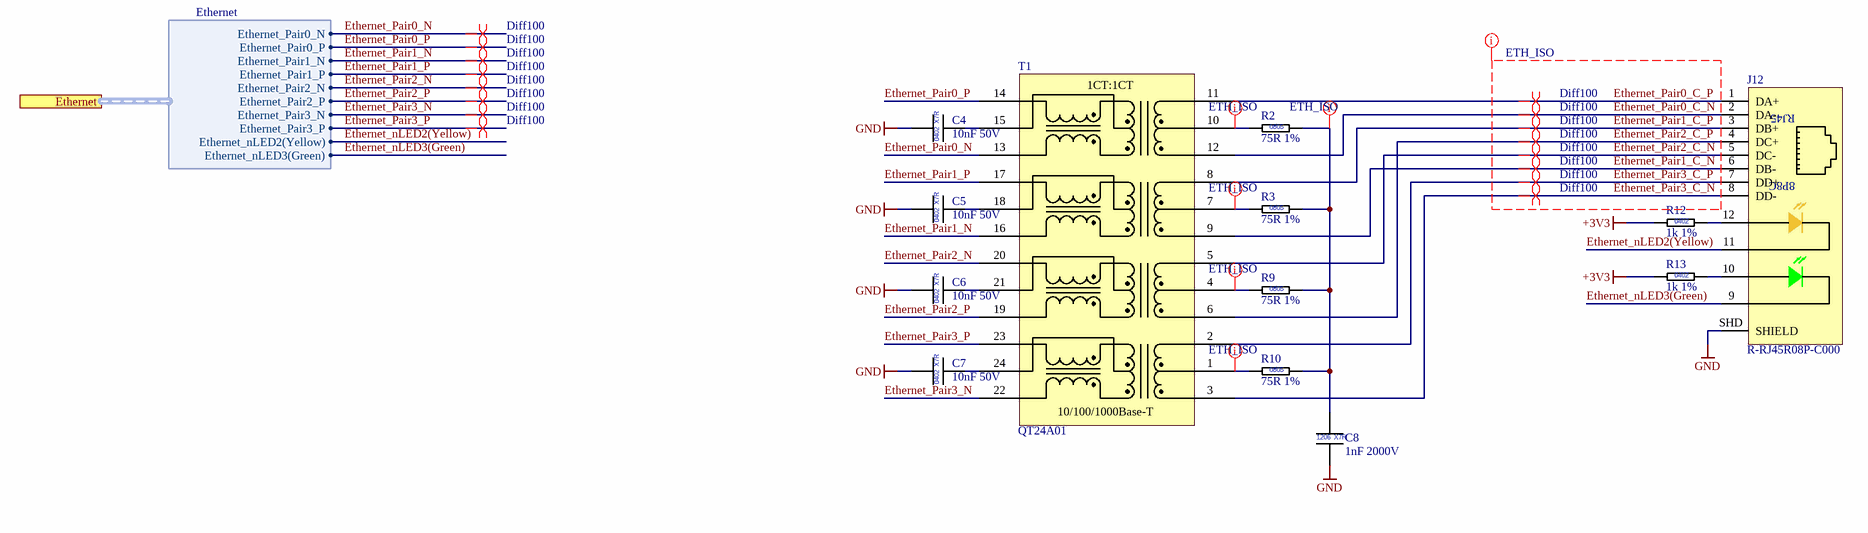
[diagram p4: 06_Ethernet.SchDoc]

### Parts
C4  10nF 50V  [CAP_0402]
C5  10nF 50V  [CAP_0402]
C6  10nF 50V  [CAP_0402]
C7  10nF 50V  [CAP_0402]
C8  1nF 2000V  [CAP_1206]
J12  R-RJ45R08P-C000  [Ckmtw - R-RJ45R08P-C000]
R2  75R 1%  [RES_0805]
R3  75R 1%  [RES_0805]
R9  75R 1%  [RES_0805]
R10  75R 1%  [RES_0805]
R12  1k 1%  [RES_0402]
R13  1k 1%  [RES_0402]
T1  QT24A01  [QT24A01]

### Ports
Ethernet (harness Ethernet)

### Harnesses
Ethernet: Ethernet_Pair0_N, Ethernet_Pair0_P, Ethernet_Pair1_N, Ethernet_Pair1_P, Ethernet_Pair2_N, Ethernet_Pair2_P, Ethernet_Pair3_N, Ethernet_Pair3_P, Ethernet_nLED2(Yellow), Ethernet_nLED3(Green)

### Nets
+3V3: R12.1 R13.1
GND: C4.1 C5.1 C6.1 C7.1 C8.2 J12.SHD(SHIELD)
Ethernet_nLED2(Yellow): J12.11 ; port Ethernet.Ethernet_nLED2(Yellow)
Ethernet_nLED3(Green): J12.9 ; port Ethernet.Ethernet_nLED3(Green)
Ethernet_Pair0_C_N: J12.2(DA-) T1.12(TD4-)
Ethernet_Pair0_C_P: J12.1(DA+) T1.11(TD4+)
Ethernet_Pair0_N: T1.13(MX4-) ; port Ethernet.Ethernet_Pair0_N
Ethernet_Pair0_P: T1.14(MX4+) ; port Ethernet.Ethernet_Pair0_P
Ethernet_Pair1_C_N: J12.6(DB-) T1.9(TD3-)
Ethernet_Pair1_C_P: J12.3(DB+) T1.8(TD3+)
Ethernet_Pair1_N: T1.16(MX3-) ; port Ethernet.Ethernet_Pair1_N
Ethernet_Pair1_P: T1.17(MX3+) ; port Ethernet.Ethernet_Pair1_P
Ethernet_Pair2_C_N: J12.5(DC-) T1.5(TD2+)
Ethernet_Pair2_C_P: J12.4(DC+) T1.6(TD2-)
Ethernet_Pair2_N: T1.20(MX2+) ; port Ethernet.Ethernet_Pair2_N
Ethernet_Pair2_P: T1.19(MX2-) ; port Ethernet.Ethernet_Pair2_P
Ethernet_Pair3_C_N: J12.8(DD-) T1.3(TD1-)
Ethernet_Pair3_C_P: J12.7(DD+) T1.2(TD1+)
Ethernet_Pair3_N: T1.22(MX1-) ; port Ethernet.Ethernet_Pair3_N
Ethernet_Pair3_P: T1.23(MX1+) ; port Ethernet.Ethernet_Pair3_P
NetC4_2: C4.2 T1.15(MCT4)
NetC5_2: C5.2 T1.18(MCT3)
NetC6_2: C6.2 T1.21(MCT2)
NetC7_2: C7.2 T1.24(MCT1)
NetC8_1: C8.1 R2.2 R3.2 R9.2 R10.2
NetJ12_10: J12.10 R13.2
NetJ12_12: J12.12 R12.2
NetR2_1: R2.1 T1.10(TCT4)
NetR3_1: R3.1 T1.7(TCT3)
NetR9_1: R9.1 T1.4(TCT2)
NetR10_1: R10.1 T1.1(TCT1)

### Layout directives
differential pair; net class Diff100: Ethernet_Pair0_C_N, Ethernet_Pair0_C_P, Ethernet_Pair0_N, Ethernet_Pair0_P, Ethernet_Pair1_C_N, Ethernet_Pair1_C_P, Ethernet_Pair1_N, Ethernet_Pair1_P, Ethernet_Pair2_C_N, Ethernet_Pair2_C_P, Ethernet_Pair2_N, Ethernet_Pair2_P, Ethernet_Pair3_C_N, Ethernet_Pair3_C_P, Ethernet_Pair3_N, Ethernet_Pair3_P
net class ETH_ISO: Ethernet_Pair0_C_N, Ethernet_Pair0_C_P, Ethernet_Pair1_C_N, Ethernet_Pair1_C_P, Ethernet_Pair2_C_N, Ethernet_Pair2_C_P, Ethernet_Pair3_C_N, Ethernet_Pair3_C_P, NetC8_1, NetR2_1, NetR3_1, NetR9_1, NetR10_1

### Notes on the sheet
- Title:
- ++CONFIDENTIAL++
- Date:
- Sheet:
- /
- Time:
- Engineer
- Elektronik- und Softwareentwicklung aus Nürnberg
- The  information  contained  in  these  documents  is  confidential,  privileged  and  only  for  the
  information of the intended recipient and may
  not be used, published or redistributed without
  the prior written consent from PCB Arts GmbH.
- Revision:
- Checked:
- https://pcb-arts.com/
- mail@pcb-arts.com
- (in symbol CAP_0402_10nF_50V) X7R; 0402
- (in symbol CAP_1206_1nF_2000V) 1206; X7R
- (in symbol QT24A01_10/100/1000Base-T  Single  Port  Transformer) 1CT:1CT; 10/100/1000Base-T
- (in symbol R-RJ45R08P-C000_RJ45 8P8C Shielded Yellow - Green Through Hole Ethernet Connectors) RJ45; 8P8C
- (in symbol RES_0402_1k_1%) 0402
- (in symbol RES_0805_75R_1%) 0805

### Library data of the parts
C4-C7 = CAP_0402_10nF_50V: Multilayer Ceramic Capacitors MLCC - SMD/SMT 0402 50VDC; Manufacturer 1: Wurth Elektronik; Manufacturer 1 Prt. Nr.: 885012205067; Manufacturer 2 Prt. Nr.: AC0402KPX7R9BB103; Manufacturer 2: Yageo
C8 = CAP_1206_1nF_2000V: Multilayer Ceramic Capacitors MLCC - SMD/SMT 1206 2000VDC; Manufacturer 1: Yageo; Manufacturer 1 Prt. Nr.: CC1206MKX7RDBB102; Manufacturer 2 Prt. Nr.: 1206B102M202CT; Manufacturer 2: Walsin
J12 = R-RJ45R08P-C000_RJ45 8P8C Shielded Yellow - Green Through Hole Ethernet Connectors: RJ45 8 1 Shielded Yellow - Green Through Hole Ethernet Connectors/Modular Connectors (RJ45 RJ11) RoHS; Manufacturer 1: Ckmtw(Shenzhen Cankemeng); Manufacturer 1 Prt. Nr.: R-RJ45R08P-C000
R2 R3 R9 R10 = RES_0805_75R_1%: Thick Film Resistors - SMD 75Ohm 1%; Manufacturer 1: Bourns; Manufacturer 1 Prt. Nr.: CR0805-FX-75R0ELF; Manufacturer 2 Prt. Nr.: ERJ-6ENF75R0V; Manufacturer 2: Panasonic
R12 R13 = RES_0402_1k_1%: as R1 on sheet 02_CM4 Module; Manufacturer 2: Yageo
T1 = QT24A01_10/100/1000Base-T  Single  Port  Transformer: 1:1 350 28 1.2 -1 -16 SMD,24PIN RJ45 Transformer RoHS; Manufacturer 1: TNK; Manufacturer 1 Prt. Nr.: QT24A01

## Sheet 03_USB.SchDoc
size A3
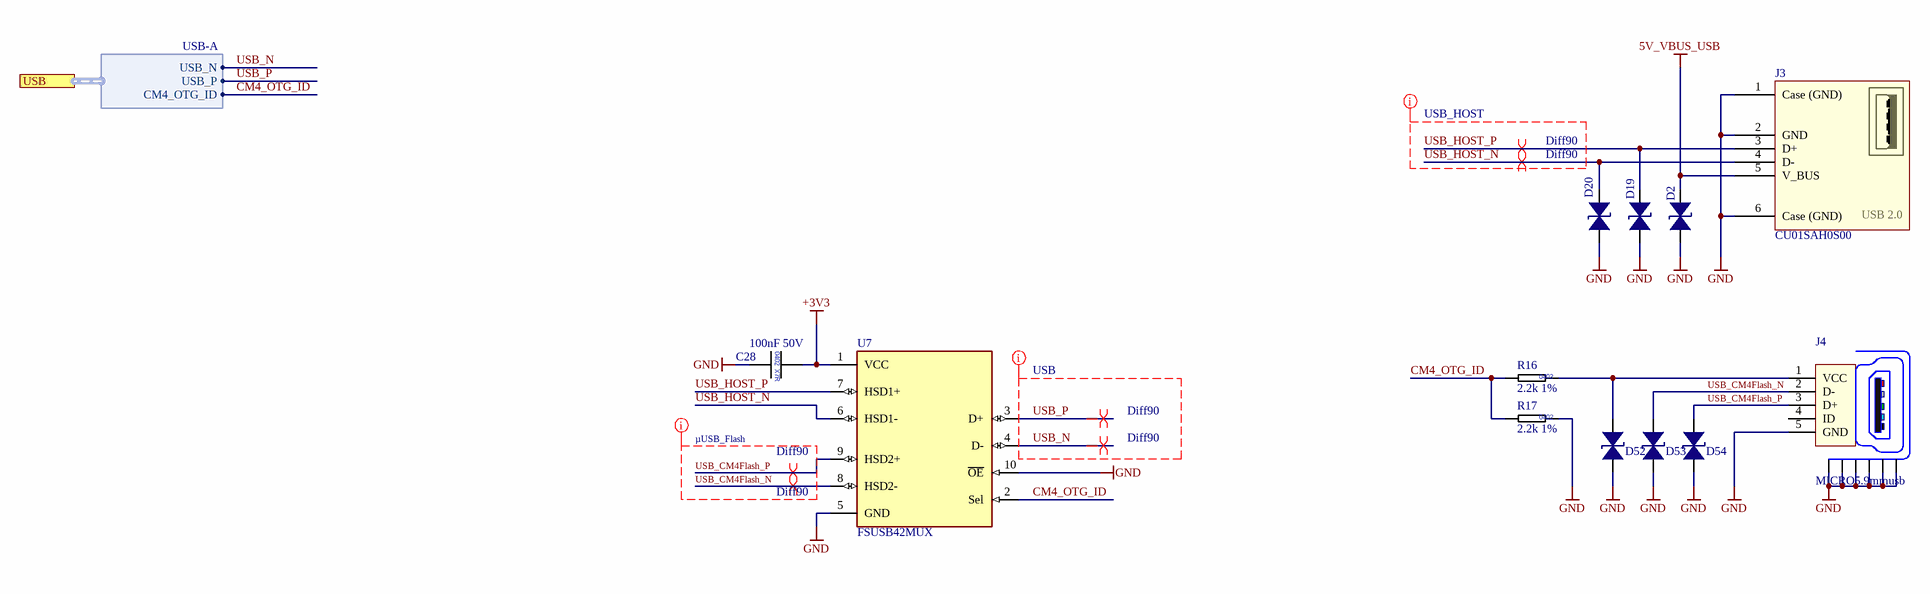
[diagram p5: 03_USB.SchDoc]

### Parts
C28  100nF 50V  [CAP_0402_L]
D2  CESDP0402UC5VB  [TVS_0402]  (value not drawn)
D19  CESDP0402UC5VB  [TVS_0402]  (value not drawn)
D20  CESDP0402UC5VB  [TVS_0402]  (value not drawn)
D52  CESDP0402UC5VB  [TVS_0402]  (value not drawn)
D53  CESDP0402UC5VB  [TVS_0402]  (value not drawn)
D54  CESDP0402UC5VB  [TVS_0402]  (value not drawn)
J3  CU01SAH0S00  [USB_A_2.0_single]
J4  MICRO5.9mmusb  [MICRO5.9mmusb]
R16  2.2k 1%  [RES_0402_L]
R17  2.2k 1%  [RES_0402_L]
U7  FSUSB42MUX  [SOP50P300X300X110-10N]

### Ports
USB (harness USB-A)

### Harnesses
USB-A: USB_N, USB_P, CM4_OTG_ID

### Nets
5V_VBUS_USB: D2.1 J3.5(V_BUS)
+3V3: C28.1 U7.1(VCC)
GND: C28.2 D2.2 D19.2 D20.2 D52.2 D53.2 D54.2 J3.1(Case_(GND)) J3.2(GND) J3.6(Case_(GND)) J4.5(GND) J4.6(Shield) J4.7(Shield) J4.8(Shield) J4.9(Shield) J4.10(Shield) J4.11(Shield) R17.1 U7.5(GND) U7.10(~{OE})
CM4_OTG_ID: R16.2 R17.2 U7.2(Sel) ; port USB.CM4_OTG_ID
USB_CM4Flash_N: D53.1 J4.2(D-) U7.8(HSD2-)
USB_CM4Flash_P: D54.1 J4.3(D+) U7.9(HSD2+)
USB_HOST_N: D20.1 J3.4(D-) U7.6(HSD1-)
USB_HOST_P: D19.1 J3.3(D+) U7.7(HSD1+)
USB_N: U7.4(D-) ; port USB.USB_N
USB_P: U7.3(D+) ; port USB.USB_P
NetD52_1: D52.1 J4.1(VCC) R16.1

Not connected (* = marked no-connect by the designer): J4 4(ID)

### Layout directives
net class USB_HOST: USB_HOST_N, USB_HOST_P
differential pair; net class Diff90; DiffPairClass: Diff90: USB_HOST_P, USB_P
differential pair; net class Diff90: USB_CM4Flash_N, USB_CM4Flash_P, USB_HOST_N, USB_N
net class µUSB_Flash: USB_CM4Flash_N, USB_CM4Flash_P
net class USB: USB_N, USB_P

### Notes on the sheet
- Title:
- ++CONFIDENTIAL++
- Date:
- Sheet:
- /
- Time:
- Engineer
- Elektronik- und Softwareentwicklung aus Nürnberg
- The  information  contained  in  these  documents  is  confidential,  privileged  and  only  for  the
  information of the intended recipient and may
  not be used, published or redistributed without
  the prior written consent from PCB Arts GmbH.
- Revision:
- Checked:
- https://pcb-arts.com/
- mail@pcb-arts.com
- (in symbol CAP_0402_100nF_50V) 0402; X7R
- (in symbol RES_0402_2.2k_1%) 0402
- (in symbol USBA_single) USB 2.0

### Library data of the parts
C28 = CAP_0402_100nF_50V: as C3 on sheet 01_Powersupply; Manufacturer 2: TDK
D2 D19 D20 D52-D54 = CESDP0402UC5VB_TVS Diode 0402: as D3 on sheet 05_Cardreader; Manufacturer 1 Prt. Nr.: CESDP0402UC5VB; Manufacturer 2: BORN
J3 = USBA_single: USB-A USB 2.0 Buchse Steckverbinder, rechtwinklig; Manufacturer 1: Cvilux USA; Manufacturer 1 Prt. Nr.: CU01SAH0S00
J4 = SMD micro USB Connector Horizontal C393940: SHOU HAN  MICRO5.9mmusb; Manufacturer 1: SHOU HAN; Manufacturer 1 Prt. Nr.: MICRO5.9mmusb
R16 R17 = RES_0402_2.2k_1%: Thick Film Resistors - SMD 2.2kOhm 1%; Manufacturer 1: Vishay / Dale; Manufacturer 1 Prt. Nr.: CRCW04022K20FKEDC; Manufacturer 2 Prt. Nr.: AF0402FR-072K2L; Manufacturer 2: Yageo
U7 = FSUSB42MUX_IC USB SWITCH DPDT: IC USB SWITCH DPDT; Manufacturer 1: onsemi / Fairchild; Manufacturer 1 Prt. Nr.: FSUSB42MUX

## Sheet 04_HDMI_Interface.SchDoc
size A3
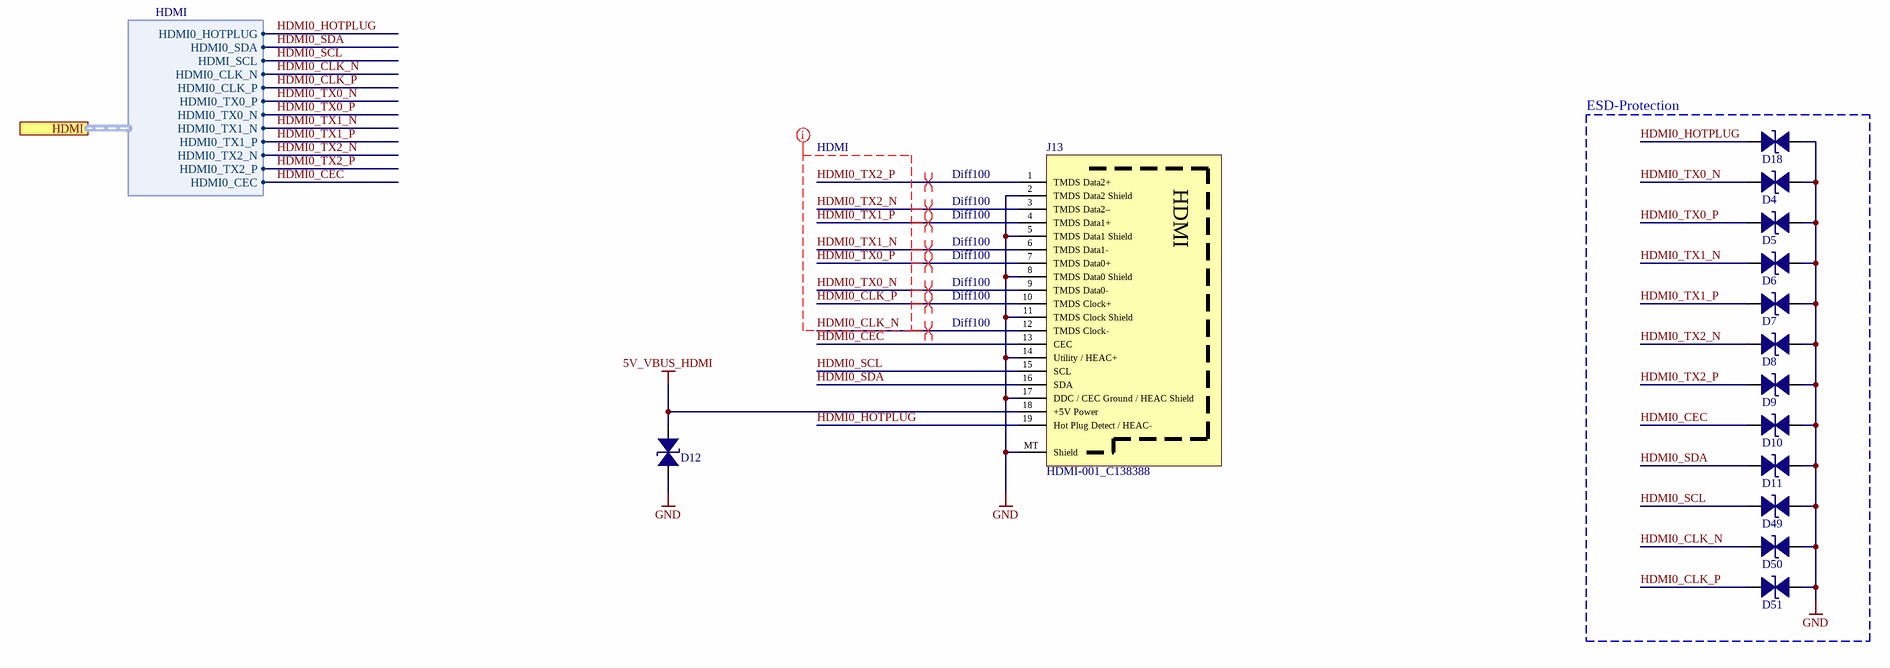
[diagram p6: 04_HDMI_Interface.SchDoc]

### Parts
D4  CESDP0402UC5VB  [TVS_0402]  (value not drawn)
D5  CESDP0402UC5VB  [TVS_0402]  (value not drawn)
D6  CESDP0402UC5VB  [TVS_0402]  (value not drawn)
D7  CESDP0402UC5VB  [TVS_0402]  (value not drawn)
D8  CESDP0402UC5VB  [TVS_0402]  (value not drawn)
D9  CESDP0402UC5VB  [TVS_0402]  (value not drawn)
D10  CESDP0402UC5VB  [TVS_0402]  (value not drawn)
D11  CESDP0402UC5VB  [TVS_0402]  (value not drawn)
D12  CESDP0402UC5VB  [TVS_0402]  (value not drawn)
D18  CESDP0402UC5VB  [TVS_0402]  (value not drawn)
D49  CESDP0402UC5VB  [TVS_0402]  (value not drawn)
D50  CESDP0402UC5VB  [TVS_0402]  (value not drawn)
D51  CESDP0402UC5VB  [TVS_0402]  (value not drawn)
J13  HDMI-001_C138388  [BOOMELE HDMI-001]

### Blocks framed on the sheet
ESD-Protection: D4-D11 D18 D49-D51

### Ports
HDMI (harness HDMI)

### Harnesses
HDMI: HDMI0_HOTPLUG, HDMI0_SDA, HDMI_SCL, HDMI0_CLK_N, HDMI0_CLK_P, HDMI0_TX0_P, HDMI0_TX0_N, HDMI0_TX1_N, HDMI0_TX1_P, HDMI0_TX2_N, HDMI0_TX2_P, HDMI0_CEC

### Nets
5V_VBUS_HDMI: D12.2 J13.18(+5V_Power)
GND: D4.2 D5.2 D6.2 D7.2 D8.2 D9.2 D10.2 D11.2 D12.1 D18.2 D49.2 D50.2 D51.2 J13.2(TMDS_Data2_Shield) J13.5(TMDS_Data1_Shield) J13.8(TMDS_Data0_Shield) J13.11(TMDS_Clock_Shield) J13.14(Utility_/_HEAC+) J13.17(DDC_/_CEC_Ground_/_HEAC_Shield) J13.MT(Shield)
HDMI0_CEC: D10.1 J13.13(CEC) ; port HDMI.HDMI0_CEC
HDMI0_CLK_N: D50.1 J13.12(TMDS_Clock-) ; port HDMI.HDMI0_CLK_N
HDMI0_CLK_P: D51.1 J13.10(TMDS_Clock+) ; port HDMI.HDMI0_CLK_P
HDMI0_HOTPLUG: D18.1 J13.19(Hot_Plug_Detect_/_HEAC-) ; port HDMI.HDMI0_HOTPLUG
HDMI0_SCL: D49.1 J13.15(SCL) ; port HDMI.HDMI_SCL
HDMI0_SDA: D11.1 J13.16(SDA) ; port HDMI.HDMI0_SDA
HDMI0_TX0_N: D4.1 J13.9(TMDS_Data0-) ; port HDMI.HDMI0_TX0_P
HDMI0_TX0_P: D5.1 J13.7(TMDS_Data0+) ; port HDMI.HDMI0_TX0_N
HDMI0_TX1_N: D6.1 J13.6(TMDS_Data1-) ; port HDMI.HDMI0_TX1_N
HDMI0_TX1_P: D7.1 J13.4(TMDS_Data1+) ; port HDMI.HDMI0_TX1_P
HDMI0_TX2_N: D8.1 J13.3(TMDS_Data2–) ; port HDMI.HDMI0_TX2_N
HDMI0_TX2_P: D9.1 J13.1(TMDS_Data2+) ; port HDMI.HDMI0_TX2_P

### Layout directives
differential pair; net class Diff100: HDMI0_CLK_N, HDMI0_CLK_P, HDMI0_TX0_N, HDMI0_TX0_P, HDMI0_TX1_N, HDMI0_TX1_P, HDMI0_TX2_N, HDMI0_TX2_P
net class HDMI: HDMI0_CLK_N, HDMI0_CLK_P, HDMI0_TX0_N, HDMI0_TX0_P, HDMI0_TX1_N, HDMI0_TX1_P, HDMI0_TX2_N, HDMI0_TX2_P

### Notes on the sheet
- Title:
- ++CONFIDENTIAL++
- Date:
- Sheet:
- /
- Time:
- Engineer
- Elektronik- und Softwareentwicklung aus Nürnberg
- The  information  contained  in  these  documents  is  confidential,  privileged  and  only  for  the
  information of the intended recipient and may
  not be used, published or redistributed without
  the prior written consent from PCB Arts GmbH.
- Revision:
- Checked:
- https://pcb-arts.com/
- mail@pcb-arts.com
- (in symbol HDMI-001_HDMI Connector 19Pin SMD) HDMI

### Library data of the parts
D4-D12 D18 D49-D51 = CESDP0402UC5VB_TVS Diode 0402: as D3 on sheet 05_Cardreader; Manufacturer 1 Prt. Nr.: CESDP0402UC5VB; Manufacturer 2: BORN
J13 = HDMI-001_HDMI Connector 19Pin SMD: HDMI Connector Female 19 Pin LCSC C138388; Manufacturer 1: BOOMELE(Boom Precision Elec); Manufacturer 1 Prt. Nr.: HDMI-001

## Sheet 07_FMC_LPC_Interface.SchDoc
size A3
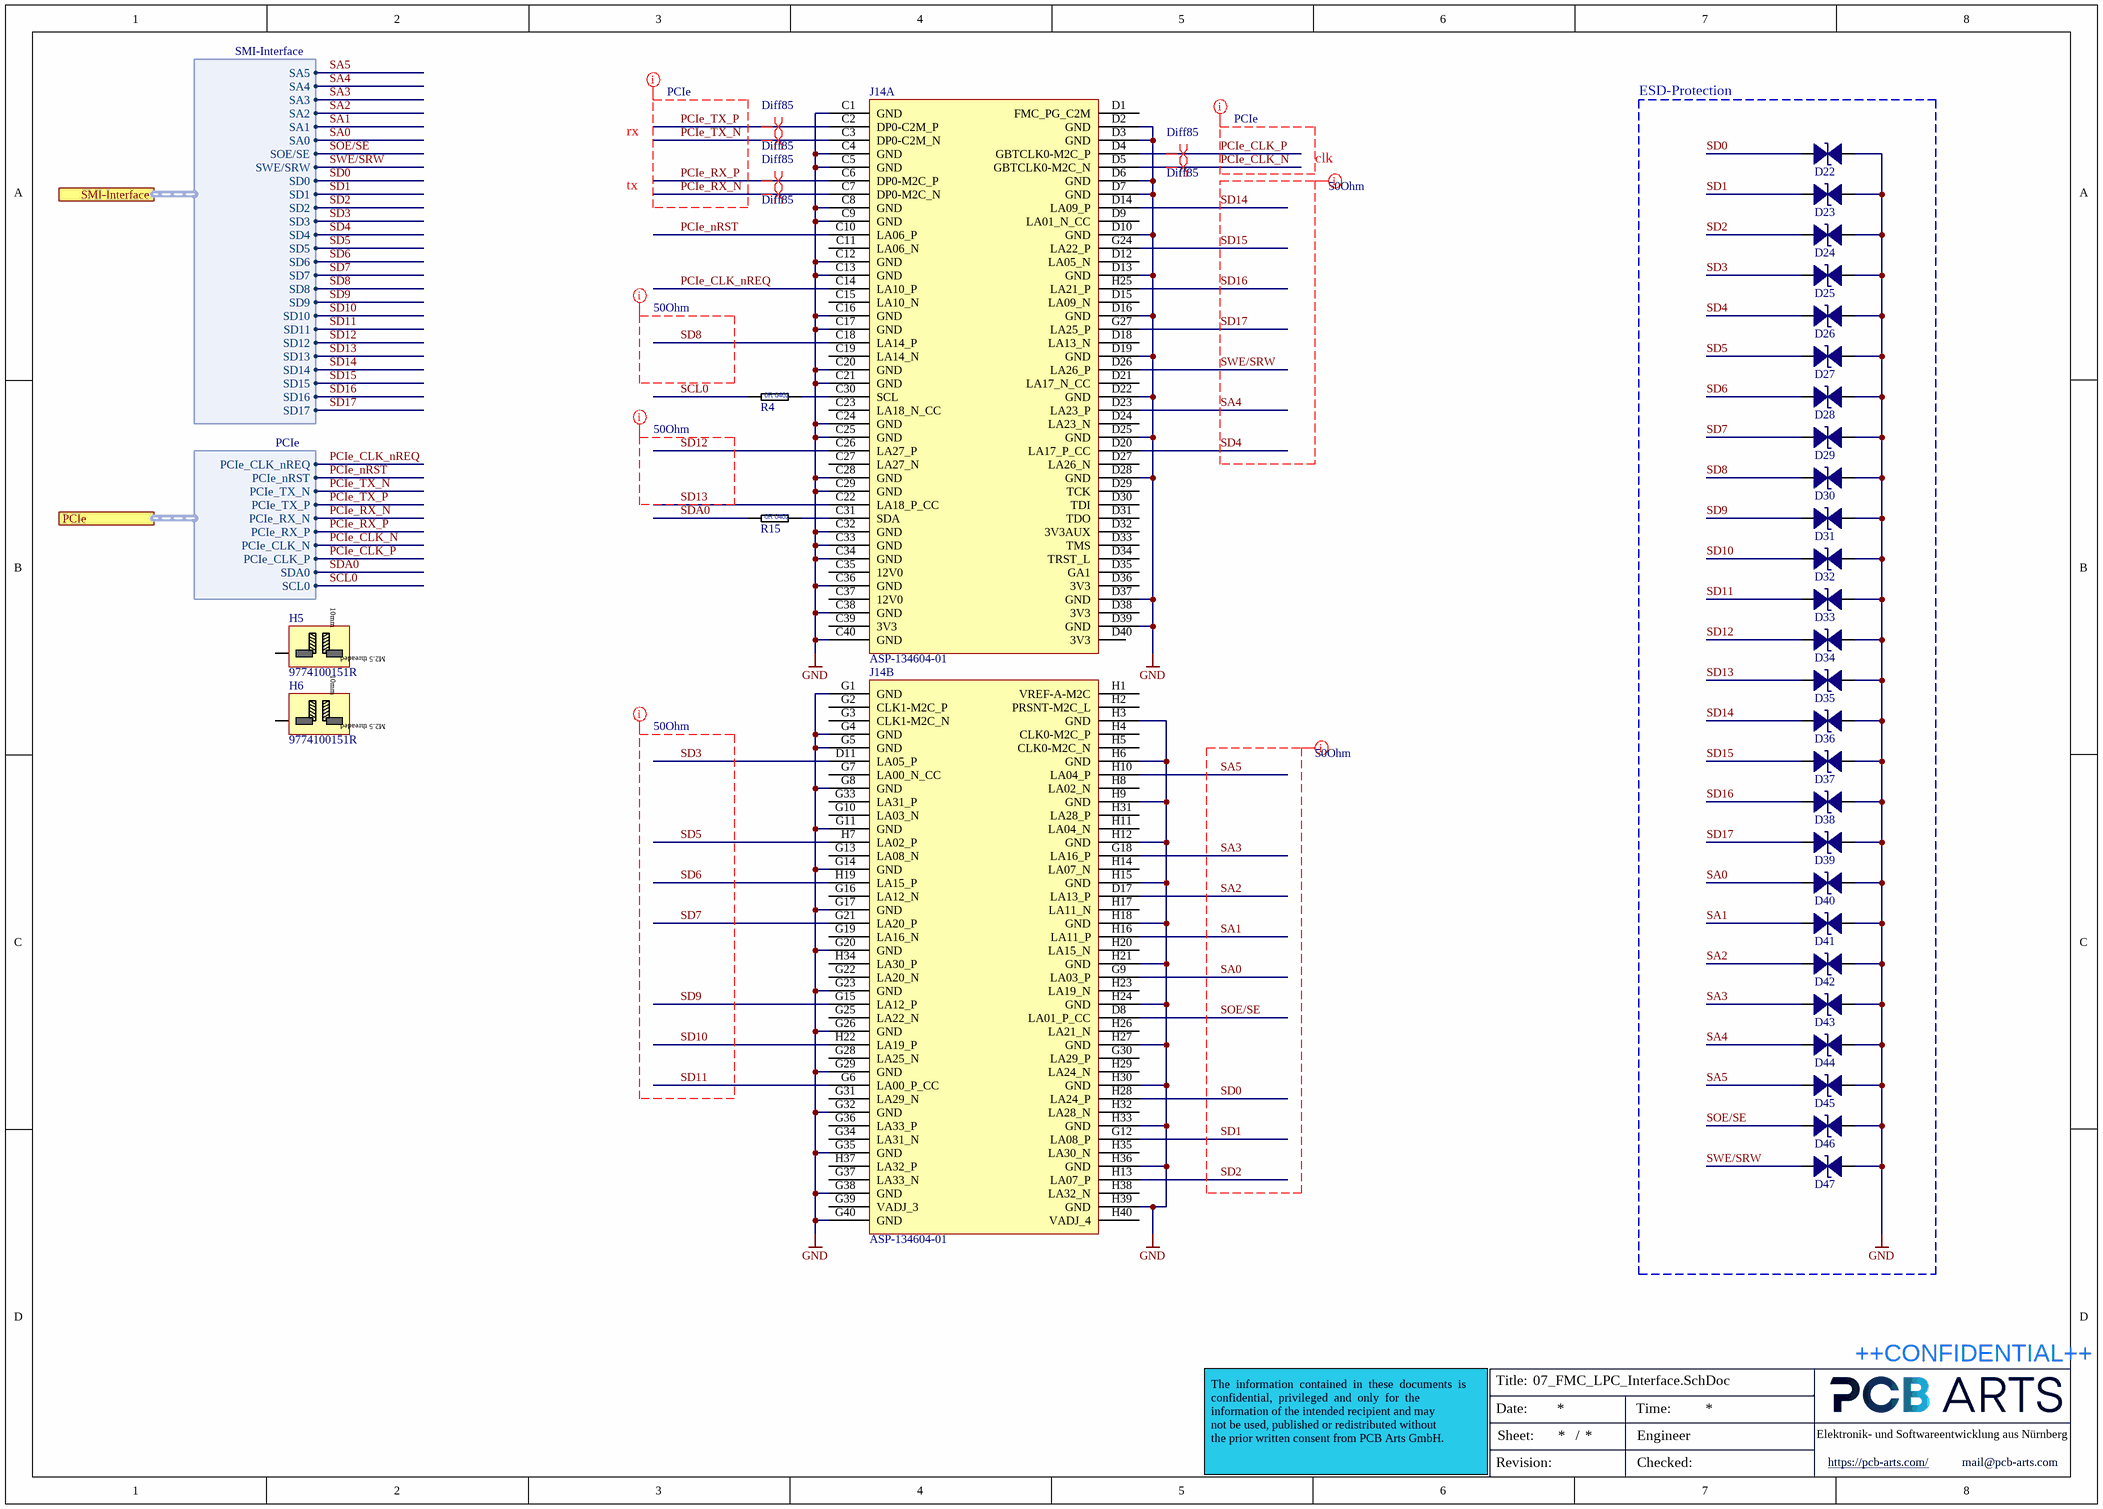
[diagram p7: 07_FMC_LPC_Interface.SchDoc]

### Parts
D22  CESDP0402UC5VB  [TVS_0402]  (value not drawn)
D23  CESDP0402UC5VB  [TVS_0402]  (value not drawn)
D24  CESDP0402UC5VB  [TVS_0402]  (value not drawn)
D25  CESDP0402UC5VB  [TVS_0402]  (value not drawn)
D26  CESDP0402UC5VB  [TVS_0402]  (value not drawn)
D27  CESDP0402UC5VB  [TVS_0402]  (value not drawn)
D28  CESDP0402UC5VB  [TVS_0402]  (value not drawn)
D29  CESDP0402UC5VB  [TVS_0402]  (value not drawn)
D30  CESDP0402UC5VB  [TVS_0402]  (value not drawn)
D31  CESDP0402UC5VB  [TVS_0402]  (value not drawn)
D32  CESDP0402UC5VB  [TVS_0402]  (value not drawn)
D33  CESDP0402UC5VB  [TVS_0402]  (value not drawn)
D34  CESDP0402UC5VB  [TVS_0402]  (value not drawn)
D35  CESDP0402UC5VB  [TVS_0402]  (value not drawn)
D36  CESDP0402UC5VB  [TVS_0402]  (value not drawn)
D37  CESDP0402UC5VB  [TVS_0402]  (value not drawn)
D38  CESDP0402UC5VB  [TVS_0402]  (value not drawn)
D39  CESDP0402UC5VB  [TVS_0402]  (value not drawn)
D40  CESDP0402UC5VB  [TVS_0402]  (value not drawn)
D41  CESDP0402UC5VB  [TVS_0402]  (value not drawn)
D42  CESDP0402UC5VB  [TVS_0402]  (value not drawn)
D43  CESDP0402UC5VB  [TVS_0402]  (value not drawn)
D44  CESDP0402UC5VB  [TVS_0402]  (value not drawn)
D45  CESDP0402UC5VB  [TVS_0402]  (value not drawn)
D46  CESDP0402UC5VB  [TVS_0402]  (value not drawn)
D47  CESDP0402UC5VB  [TVS_0402]  (value not drawn)
H5  9774100151R  [9774100151R]
H6  9774100151R  [9774100151R]
J14  ASP-134604-01  [ASP-134604-01]  (parts A,B of 2)
R4  0R Jumper  [RES_0402]  (value not drawn)
R15  0R Jumper  [RES_0402]  (value not drawn)

### Blocks framed on the sheet
ESD-Protection: D22-D47

### Ports
PCIe (harness PCIe), SMI-Interface (harness SMI-Interface)

### Harnesses
SMI-Interface: SA5, SA4, SA3, SA2, SA1, SA0, SOE/SE, SWE/SRW, SD0, SD1, SD2, SD3, SD4, SD5, SD6, SD7, SD8, SD9, SD10, SD11, SD12, SD13, SD14, SD15, SD16, SD17
PCIe: PCIe_CLK_nREQ, PCIe_nRST, PCIe_TX_N, PCIe_TX_P, PCIe_RX_N, PCIe_RX_P, PCIe_CLK_N, PCIe_CLK_P, SDA0, SCL0

### Nets
GND: D22.2 D23.2 D24.2 D25.2 D26.2 D27.2 D28.2 D29.2 D30.2 D31.2 D32.2 D33.2 D34.2 D35.2 D36.2 D37.2 D38.2 D39.2 D40.2 D41.2 D42.2 D43.2 D44.2 D45.2 D46.2 D47.2 J14.C1(GND) J14.C4(GND) J14.C5(GND) J14.C8(GND) J14.C9(GND) J14.C12(GND) J14.C13(GND) J14.C16(GND) J14.C17(GND) J14.C20(GND) J14.C21(GND) J14.C24(GND) J14.C25(GND) J14.C28(GND) J14.C29(GND) J14.C32(GND) J14.C33(GND) J14.C34(GND) J14.C36(GND) J14.C38(GND) J14.C40(GND) J14.D2(GND) J14.D3(GND) J14.D6(GND) J14.D7(GND) J14.D10(GND) J14.D13(GND) J14.D16(GND) J14.D19(GND) J14.D22(GND) J14.D25(GND) J14.D28(GND) J14.D37(GND) J14.D39(GND) J14.G1(GND) J14.G4(GND) J14.G5(GND) J14.G8(GND) J14.G11(GND) J14.G14(GND) J14.G17(GND) J14.G20(GND) J14.G23(GND) J14.G26(GND) J14.G29(GND) J14.G32(GND) J14.G35(GND) J14.G38(GND) J14.G40(GND) J14.H3(GND) J14.H6(GND) J14.H9(GND) J14.H12(GND) J14.H15(GND) J14.H18(GND) J14.H21(GND) J14.H24(GND) J14.H27(GND) J14.H30(GND) J14.H33(GND) J14.H36(GND) J14.H39(GND)
PCIe_CLK_N: J14.D5(GBTCLK0-M2C_N) ; port PCIe.PCIe_CLK_N
PCIe_CLK_nREQ: J14.C14(LA10_P) ; port PCIe.PCIe_CLK_nREQ
PCIe_CLK_P: J14.D4(GBTCLK0-M2C_P) ; port PCIe.PCIe_CLK_P
PCIe_nRST: J14.C10(LA06_P) ; port PCIe.PCIe_nRST
PCIe_RX_N: J14.C7(DP0-M2C_N) ; port PCIe.PCIe_RX_N
PCIe_RX_P: J14.C6(DP0-M2C_P) ; port PCIe.PCIe_RX_P
PCIe_TX_N: J14.C3(DP0-C2M_N) ; port PCIe.PCIe_TX_N
PCIe_TX_P: J14.C2(DP0-C2M_P) ; port PCIe.PCIe_TX_P
SA0: D40.1 J14.G9(LA03_P) ; port SMI-Interface.SA0
SA1: D41.1 J14.H16(LA11_P) ; port SMI-Interface.SA1
SA2: D42.1 J14.D17(LA13_P) ; port SMI-Interface.SA2
SA3: D43.1 J14.G18(LA16_P) ; port SMI-Interface.SA3
SA4: D44.1 J14.D23(LA23_P) ; port SMI-Interface.SA4
SA5: D45.1 J14.H10(LA04_P) ; port SMI-Interface.SA5
SCL0: R4.1 ; port PCIe.SCL0
SD0: D22.1 J14.H28(LA24_P) ; port SMI-Interface.SD0
SD1: D23.1 J14.G12(LA08_P) ; port SMI-Interface.SD1
SD2: D24.1 J14.H13(LA07_P) ; port SMI-Interface.SD2
SD3: D25.1 J14.D11(LA05_P) ; port SMI-Interface.SD3
SD4: D26.1 J14.D20(LA17_P_CC) ; port SMI-Interface.SD4
SD5: D27.1 J14.H7(LA02_P) ; port SMI-Interface.SD5
SD6: D28.1 J14.H19(LA15_P) ; port SMI-Interface.SD6
SD7: D29.1 J14.G21(LA20_P) ; port SMI-Interface.SD7
SD8: D30.1 J14.C18(LA14_P) ; port SMI-Interface.SD8
SD9: D31.1 J14.G15(LA12_P) ; port SMI-Interface.SD9
SD10: D32.1 J14.H22(LA19_P) ; port SMI-Interface.SD10
SD11: D33.1 J14.G6(LA00_P_CC) ; port SMI-Interface.SD11
SD12: D34.1 J14.C26(LA27_P) ; port SMI-Interface.SD12
SD13: D35.1 J14.C22(LA18_P_CC) ; port SMI-Interface.SD13
SD14: D36.1 J14.D14(LA09_P) ; port SMI-Interface.SD14
SD15: D37.1 J14.G24(LA22_P) ; port SMI-Interface.SD15
SD16: D38.1 J14.H25(LA21_P) ; port SMI-Interface.SD16
SD17: D39.1 J14.G27(LA25_P) ; port SMI-Interface.SD17
SDA0: R15.1 ; port PCIe.SDA0
SOE/SE: D46.1 J14.D8(LA01_P_CC) ; port SMI-Interface.SOE/SE
SWE/SRW: D47.1 J14.D26(LA26_P) ; port SMI-Interface.SWE/SRW
NetJ14_C30: J14.C30(SCL) R4.2
NetJ14_C31: J14.C31(SDA) R15.2

Not connected (* = marked no-connect by the designer): H5 1; H6 1; J14 C11(LA06_N) C15(LA10_N) C19(LA14_N) C23(LA18_N_CC) C27(LA27_N) C35(12V0) C37(12V0) C39(3V3) D1(FMC_PG_C2M) D9(LA01_N_CC) D12(LA05_N) D15(LA09_N) D18(LA13_N) D21(LA17_N_CC) D24(LA23_N) D27(LA26_N) D29(TCK) D30(TDI) D31(TDO) D32(3V3AUX) D33(TMS) D34(TRST_L) D35(GA1) D36(3V3) D38(3V3) D40(3V3) G2(CLK1-M2C_P) G3(CLK1-M2C_N) G7(LA00_N_CC) G10(LA03_N) G13(LA08_N) G16(LA12_N) G19(LA16_N) G22(LA20_N) G25(LA22_N) G28(LA25_N) G30(LA29_P) G31(LA29_N) G33(LA31_P) G34(LA31_N) G36(LA33_P) G37(LA33_N) G39(VADJ_3) H1(VREF-A-M2C) H2(PRSNT-M2C_L) H4(CLK0-M2C_P) H5(CLK0-M2C_N) H8(LA02_N) H11(LA04_N) H14(LA07_N) H17(LA11_N) H20(LA15_N) H23(LA19_N) H26(LA21_N) H29(LA24_N) H31(LA28_P) H32(LA28_N) H34(LA30_P) H35(LA30_N) H37(LA32_P) H38(LA32_N) H40(VADJ_4)

### Layout directives
net class 50Ohm: SA0, SA1, SA2, SA3, SA4, SA5, SD0, SD1, SD2, SD3, SD4, SD5, SD6, SD7, SD8, SD9, SD10, SD11, SD12, SD13, SD14, SD15, SD16, SD17, SOE/SE, SWE/SRW
differential pair; net class Diff85: PCIe_CLK_N, PCIe_CLK_P, PCIe_RX_N, PCIe_RX_P, PCIe_TX_N, PCIe_TX_P
net class PCIe: PCIe_CLK_N, PCIe_CLK_P, PCIe_RX_N, PCIe_RX_P, PCIe_TX_N, PCIe_TX_P

### Notes on the sheet
- rx
- clk
- tx
- Title:
- ++CONFIDENTIAL++
- Date:
- Sheet:
- /
- Time:
- Engineer
- Elektronik- und Softwareentwicklung aus Nürnberg
- The  information  contained  in  these  documents  is  confidential,  privileged  and  only  for  the
  information of the intended recipient and may
  not be used, published or redistributed without
  the prior written consent from PCB Arts GmbH.
- Revision:
- Checked:
- https://pcb-arts.com/
- mail@pcb-arts.com
- (in symbol RES_0402_0R Jumper) 0R 0402
- (in symbol Würth Standoff M2.5 h:5mm_1) 10mm; M2.5 threaded

### Library data of the parts
D22-D47 = CESDP0402UC5VB_TVS Diode 0402: as D3 on sheet 05_Cardreader; Manufacturer 1 Prt. Nr.: CESDP0402UC5VB; Manufacturer 2: BORN
H5 H6 = Würth Standoff M2.5 h:5mm_1: Würth Standoff M2.5 h:10mm 9774050151R; Manufacturer 1: Würth Elektronik; Manufacturer 1 Prt. Nr.: 9774100151R
J14 = ASP-134604-01_Female FMC-Connector mating plug: Female FMC-Connector mating plug; Manufacturer 1: Samtec; Manufacturer 1 Prt. Nr.: ASP-134604-01
R4 R15 = RES_0402_0R Jumper: Thick Film Resistors - SMD 0Ohm; Manufacturer 1: Vishay / Dale; Manufacturer 1 Prt. Nr.: CRCW04020000Z0EDC; Manufacturer 2 Prt. Nr.: RC0402JR-070RL; Manufacturer 2: Yageo

## Nets that join several sheets
5V_SYS: 01_Powersupply (14 pins), 02_CM4 Module (8 pins)
5V_VBUS_HDMI: 01_Powersupply (C9.1 C22.1 U2.5 U2.6), 04_HDMI_Interface (D12.2 J13.18)
5V_VBUS_USB: 01_Powersupply (C1.1 C10.1 U1.1), 03_USB (D2.1 J3.5)
+3V3: 02_CM4 Module (7 pins), 05_Cardreader (C25.2 R11.2 U3.5), 06_Ethernet (R12.1 R13.1), 03_USB (C28.1 U7.1)
GND: 01_Powersupply (27 pins), 02_CM4 Module (57 pins), 05_Cardreader (15 pins), 06_Ethernet (6 pins), 03_USB (20 pins), 04_HDMI_Interface (20 pins), 07_FMC_LPC_Interface (88 pins)
CM4_OTG_ID: 02_CM4 Module (J2.101), 03_USB (R16.2 R17.2 U7.2)
Ethernet_nLED2(Yellow): 02_CM4 Module (J1.17), 06_Ethernet (J12.11)
Ethernet_nLED3(Green): 02_CM4 Module (J1.15), 06_Ethernet (J12.9)
Ethernet_Pair0_N: 02_CM4 Module (J1.10), 06_Ethernet (T1.13)
Ethernet_Pair0_P: 02_CM4 Module (J1.12), 06_Ethernet (T1.14)
Ethernet_Pair1_N: 02_CM4 Module (J1.6), 06_Ethernet (T1.16)
Ethernet_Pair1_P: 02_CM4 Module (J1.4), 06_Ethernet (T1.17)
Ethernet_Pair2_N: 02_CM4 Module (J1.9), 06_Ethernet (T1.20)
Ethernet_Pair2_P: 02_CM4 Module (J1.11), 06_Ethernet (T1.19)
Ethernet_Pair3_N: 02_CM4 Module (J1.5), 06_Ethernet (T1.22)
Ethernet_Pair3_P: 02_CM4 Module (J1.3), 06_Ethernet (T1.23)
HDMI0_CEC: 02_CM4 Module (J2.151), 04_HDMI_Interface (D10.1 J13.13)
HDMI0_CLK_N: 02_CM4 Module (J2.190), 04_HDMI_Interface (D50.1 J13.12)
HDMI0_CLK_P: 02_CM4 Module (J2.188), 04_HDMI_Interface (D51.1 J13.10)
HDMI0_HOTPLUG: 02_CM4 Module (J2.153), 04_HDMI_Interface (D18.1 J13.19)
HDMI0_SCL: 02_CM4 Module (J2.200), 04_HDMI_Interface (D49.1 J13.15)
HDMI0_SDA: 02_CM4 Module (J2.199), 04_HDMI_Interface (D11.1 J13.16)
HDMI0_TX0_N: 02_CM4 Module (J2.184), 04_HDMI_Interface (D4.1 J13.9)
HDMI0_TX0_P: 02_CM4 Module (J2.182), 04_HDMI_Interface (D5.1 J13.7)
HDMI0_TX1_N: 02_CM4 Module (J2.178), 04_HDMI_Interface (D6.1 J13.6)
HDMI0_TX1_P: 02_CM4 Module (J2.176), 04_HDMI_Interface (D7.1 J13.4)
HDMI0_TX2_N: 02_CM4 Module (J2.172), 04_HDMI_Interface (D8.1 J13.3)
HDMI0_TX2_P: 02_CM4 Module (J2.170), 04_HDMI_Interface (D9.1 J13.1)
PCIe_CLK_N: 02_CM4 Module (J2.112), 07_FMC_LPC_Interface (J14.D5)
PCIe_CLK_nREQ: 02_CM4 Module (J2.102), 07_FMC_LPC_Interface (J14.C14)
PCIe_CLK_P: 02_CM4 Module (J2.110), 07_FMC_LPC_Interface (J14.D4)
PCIe_nRST: 02_CM4 Module (J2.109), 07_FMC_LPC_Interface (J14.C10)
PCIe_RX_N: 02_CM4 Module (J2.118), 07_FMC_LPC_Interface (J14.C7)
PCIe_RX_P: 02_CM4 Module (J2.116), 07_FMC_LPC_Interface (J14.C6)
PCIe_TX_N: 02_CM4 Module (J2.124), 07_FMC_LPC_Interface (J14.C3)
PCIe_TX_P: 02_CM4 Module (J2.122), 07_FMC_LPC_Interface (J14.C2)
SA0: 02_CM4 Module (J1.34), 07_FMC_LPC_Interface (D40.1 J14.G9)
SA1: 02_CM4 Module (J1.54), 07_FMC_LPC_Interface (D41.1 J14.H16)
SA2: 02_CM4 Module (J1.56), 07_FMC_LPC_Interface (D42.1 J14.D17)
SA3: 02_CM4 Module (J1.58), 07_FMC_LPC_Interface (D43.1 J14.G18)
SA4: 02_CM4 Module (J1.35), 07_FMC_LPC_Interface (D44.1 J14.D23)
SA5: 02_CM4 Module (J1.36), 07_FMC_LPC_Interface (D45.1 J14.H10)
SCL0: 02_CM4 Module (J1.80 J10.2), 07_FMC_LPC_Interface (R4.1)
SD0: 02_CM4 Module (J1.39), 07_FMC_LPC_Interface (D22.1 J14.H28)
SD1: 02_CM4 Module (J1.40), 07_FMC_LPC_Interface (D23.1 J14.G12)
SD2: 02_CM4 Module (J1.44), 07_FMC_LPC_Interface (D24.1 J14.H13)
SD3: 02_CM4 Module (J1.38), 07_FMC_LPC_Interface (D25.1 J14.D11)
SD4: 02_CM4 Module (J1.31), 07_FMC_LPC_Interface (D26.1 J14.D20)
SD5: 02_CM4 Module (J1.28), 07_FMC_LPC_Interface (D27.1 J14.H7)
SD6: 02_CM4 Module (J1.55), 07_FMC_LPC_Interface (D28.1 J14.H19)
SD7: 02_CM4 Module (J1.51), 07_FMC_LPC_Interface (D29.1 J14.G21)
SD8: 02_CM4 Module (J1.29), 07_FMC_LPC_Interface (D30.1 J14.C18)
SD9: 02_CM4 Module (J1.50), 07_FMC_LPC_Interface (D31.1 J14.G15)
SD10: 02_CM4 Module (J1.49), 07_FMC_LPC_Interface (D32.1 J14.H22)
SD11: 02_CM4 Module (J1.26), 07_FMC_LPC_Interface (D33.1 J14.G6)
SD12: 02_CM4 Module (J1.27), 07_FMC_LPC_Interface (D34.1 J14.C26)
SD13: 02_CM4 Module (J1.25), 07_FMC_LPC_Interface (D35.1 J14.C22)
SD14: 02_CM4 Module (J1.46), 07_FMC_LPC_Interface (D36.1 J14.D14)
SD15: 02_CM4 Module (J1.47), 07_FMC_LPC_Interface (D37.1 J14.G24)
SD16: 02_CM4 Module (J1.45), 07_FMC_LPC_Interface (D38.1 J14.H25)
SD17: 02_CM4 Module (J1.41), 07_FMC_LPC_Interface (D39.1 J14.G27)
SD_CLK: 02_CM4 Module (J1.57), 05_Cardreader (D16.1 J11.5)
SD_CMD: 02_CM4 Module (J1.62), 05_Cardreader (D48.1 J11.3)
SD_DAT0: 02_CM4 Module (J1.63), 05_Cardreader (D3.1 J11.7)
SD_DAT1: 02_CM4 Module (J1.67), 05_Cardreader (D13.1 J11.8)
SD_DAT2: 02_CM4 Module (J1.69), 05_Cardreader (D14.1 J11.1)
SD_DAT3: 02_CM4 Module (J1.61), 05_Cardreader (D17.1 J11.2)
SD_PWR_ON: 02_CM4 Module (J1.75), 05_Cardreader (R11.1 U3.4)
SDA0: 02_CM4 Module (J1.82 J10.1), 07_FMC_LPC_Interface (R15.1)
SOE/SE: 02_CM4 Module (J1.30), 07_FMC_LPC_Interface (D46.1 J14.D8)
SWE/SRW: 02_CM4 Module (J1.37), 07_FMC_LPC_Interface (D47.1 J14.D26)
USB_N: 02_CM4 Module (J2.103), 03_USB (U7.4)
USB_P: 02_CM4 Module (J2.105), 03_USB (U7.3)